# Altium project SLRC_Robot.PrjPcb (part 1 of 2)
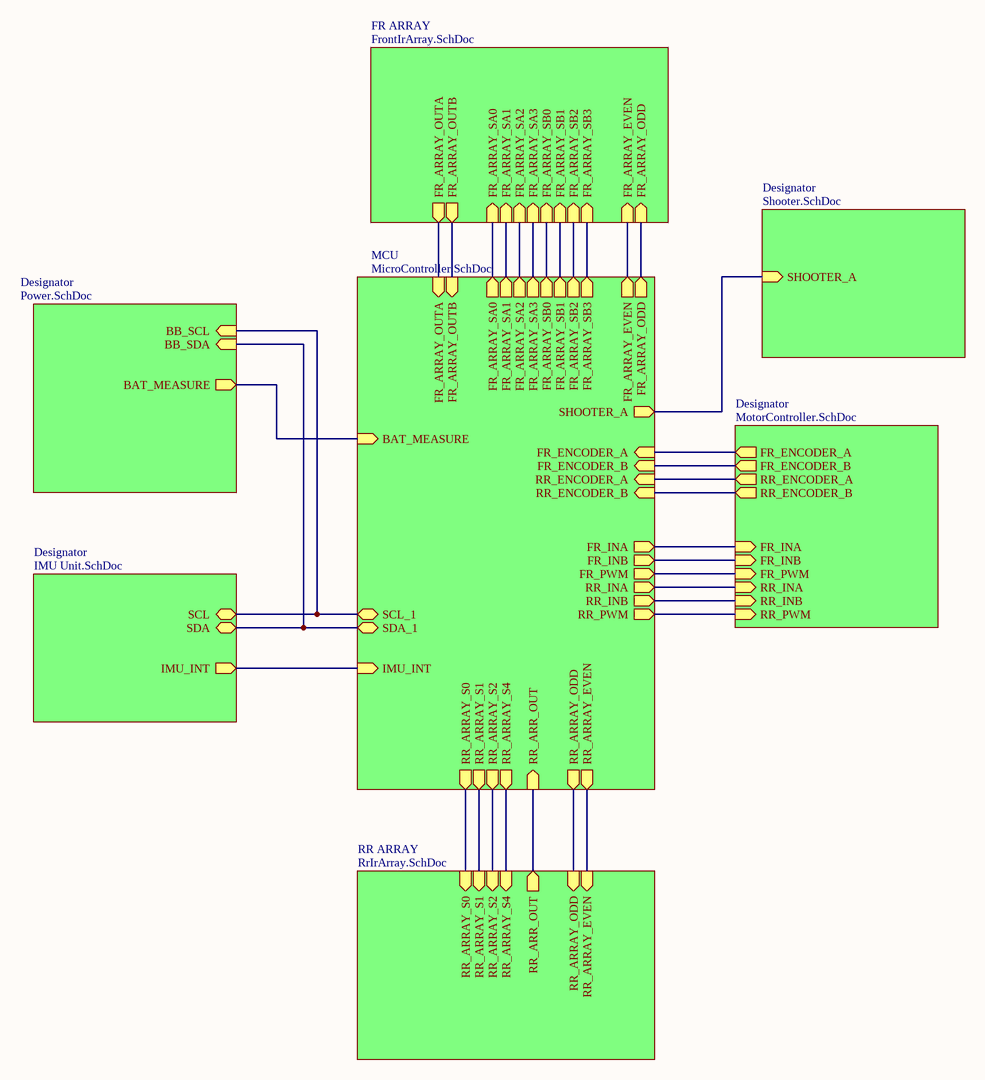
[diagram p0: Main.SchDoc]
11 sheets, 120 parts. Net scope: hierarchical (ports join the sheet entries above them; power ports are global).
Board file: RobotPCB.PcbDoc
Sheets:
  Main.SchDoc
    MCU = MicroController.SchDoc
    Designator = MotorController.SchDoc
    Designator = Shooter.SchDoc
    FR ARRAY = FrontIrArray.SchDoc
    RR ARRAY = RrIrArray.SchDoc
    Designator = IMU Unit.SchDoc
    Designator = Power.SchDoc
      Buck Converter = BuckConverter.SchDoc
      Buck Boost Converter = BuckBoost.SchDoc
      3.3V LDO = 3.3V_LDO.SchDoc

## Sheet Main.SchDoc
size B; SheetNumber: 1; SheetTotal: 11

### Sub-sheets
Designator = MotorController.SchDoc: FR_ENCODER_A (out), FR_ENCODER_B (out), RR_ENCODER_A (out), RR_ENCODER_B (out), FR_INA (in), FR_INB (in), FR_PWM (in), RR_INA (in), RR_INB (in), RR_PWM (in)
Designator = Shooter.SchDoc: SHOOTER_A (in)
Designator = IMU Unit.SchDoc: SCL (bidir), SDA (bidir), IMU_INT (out)
Designator = Power.SchDoc: BAT_MEASURE (out), BB_SCL (in), BB_SDA (in)
FR ARRAY = FrontIrArray.SchDoc: FR_ARRAY_SA0 (in), FR_ARRAY_SA1 (in), FR_ARRAY_SA2 (in), FR_ARRAY_SA3 (in), FR_ARRAY_SB0 (in), FR_ARRAY_SB1 (in), FR_ARRAY_SB2 (in), FR_ARRAY_SB3 (in), FR_ARRAY_OUTA (out), FR_ARRAY_OUTB (out), FR_ARRAY_EVEN (in), FR_ARRAY_ODD (in)
MCU = MicroController.SchDoc: SCL_1 (bidir), SDA_1 (bidir), IMU_INT (in), FR_ENCODER_A (in), FR_ENCODER_B (in), RR_ENCODER_A (in), RR_ENCODER_B (in), FR_INA (out), FR_INB (out), FR_PWM (out), RR_INA (out), RR_INB (out), RR_PWM (out), RR_ARRAY_S0 (out), RR_ARRAY_S1 (out), RR_ARRAY_S2 (out), RR_ARRAY_S4 (out), RR_ARR_OUT (in), FR_ARRAY_SA0 (out), FR_ARRAY_SA1 (out), FR_ARRAY_SA2 (out), FR_ARRAY_SA3 (out), FR_ARRAY_SB0 (out), FR_ARRAY_SB1 (out), FR_ARRAY_SB2 (out), FR_ARRAY_SB3 (out), FR_ARRAY_OUTA (in), FR_ARRAY_OUTB (in), BAT_MEASURE (in), SHOOTER_A (out), FR_ARRAY_EVEN (out), FR_ARRAY_ODD (out), RR_ARRAY_ODD (out), RR_ARRAY_EVEN (out)
RR ARRAY = RrIrArray.SchDoc: RR_ARRAY_S0 (in), RR_ARRAY_S1 (in), RR_ARRAY_S2 (in), RR_ARRAY_S4 (in), RR_ARR_OUT (out), RR_ARRAY_ODD (in), RR_ARRAY_EVEN (in)

### Nets
MCU_SCL_1: sheet MCU/SCL_1, sheet Designator/SCL, sheet Designator/BB_SCL
MCU_SDA_1: sheet MCU/SDA_1, sheet Designator/SDA, sheet Designator/BB_SDA
NetIC1_1: sheet MCU/FR_ARRAY_OUTA, sheet FR ARRAY/FR_ARRAY_OUTA
NetIC1_10: sheet MCU/FR_ARRAY_SA0, sheet FR ARRAY/FR_ARRAY_SA0
NetIC1_11: sheet MCU/FR_ARRAY_SA1, sheet FR ARRAY/FR_ARRAY_SA1
NetIC1_13: sheet MCU/FR_ARRAY_SA3, sheet FR ARRAY/FR_ARRAY_SA3
NetIC1_14: sheet MCU/FR_ARRAY_SA2, sheet FR ARRAY/FR_ARRAY_SA2
NetIC2_1: sheet MCU/FR_ARRAY_OUTB, sheet FR ARRAY/FR_ARRAY_OUTB
NetIC2_10: sheet MCU/FR_ARRAY_SB0, sheet FR ARRAY/FR_ARRAY_SB0
NetIC2_11: sheet MCU/FR_ARRAY_SB1, sheet FR ARRAY/FR_ARRAY_SB1
NetIC2_13: sheet MCU/FR_ARRAY_SB3, sheet FR ARRAY/FR_ARRAY_SB3
NetIC2_14: sheet MCU/FR_ARRAY_SB2, sheet FR ARRAY/FR_ARRAY_SB2
NetIC3_1: sheet MCU/RR_ARR_OUT, sheet RR ARRAY/RR_ARR_OUT
NetIC3_10: sheet MCU/RR_ARRAY_S0, sheet RR ARRAY/RR_ARRAY_S0
NetIC3_11: sheet MCU/RR_ARRAY_S1, sheet RR ARRAY/RR_ARRAY_S1
NetIC3_13: sheet MCU/RR_ARRAY_S4, sheet RR ARRAY/RR_ARRAY_S4
NetIC3_14: sheet MCU/RR_ARRAY_S2, sheet RR ARRAY/RR_ARRAY_S2
NetIC6_5: sheet MCU/SHOOTER_A, sheet Designator/SHOOTER_A
NetJ20_2: sheet MCU/RR_PWM, sheet Designator/RR_PWM
NetJ20_4: sheet MCU/RR_INB, sheet Designator/RR_INB
NetJ20_5: sheet MCU/RR_INA, sheet Designator/RR_INA
NetJ20_6: sheet MCU/FR_PWM, sheet Designator/FR_PWM
NetJ20_8: sheet MCU/FR_INB, sheet Designator/FR_INB
NetJ20_9: sheet MCU/FR_INA, sheet Designator/FR_INA
NetJ22_5: sheet MCU/FR_ENCODER_A, sheet Designator/FR_ENCODER_A
NetJ22_6: sheet MCU/FR_ENCODER_B, sheet Designator/FR_ENCODER_B
NetJ24_5: sheet MCU/RR_ENCODER_A, sheet Designator/RR_ENCODER_A
NetJ24_6: sheet MCU/RR_ENCODER_B, sheet Designator/RR_ENCODER_B
NetP3_17: sheet MCU/RR_ARRAY_ODD, sheet RR ARRAY/RR_ARRAY_ODD
NetP3_18: sheet MCU/RR_ARRAY_EVEN, sheet RR ARRAY/RR_ARRAY_EVEN
NetP4_5: sheet MCU/FR_ARRAY_EVEN, sheet FR ARRAY/FR_ARRAY_EVEN
NetP4_6: sheet MCU/FR_ARRAY_ODD, sheet FR ARRAY/FR_ARRAY_ODD
NetR15_1: sheet MCU/BAT_MEASURE, sheet Designator/BAT_MEASURE
NetU1_5: sheet MCU/IMU_INT, sheet Designator/IMU_INT

## Sheet MicroController.SchDoc
size 680 x 279 mm; SheetNumber: 2; SheetTotal: 11
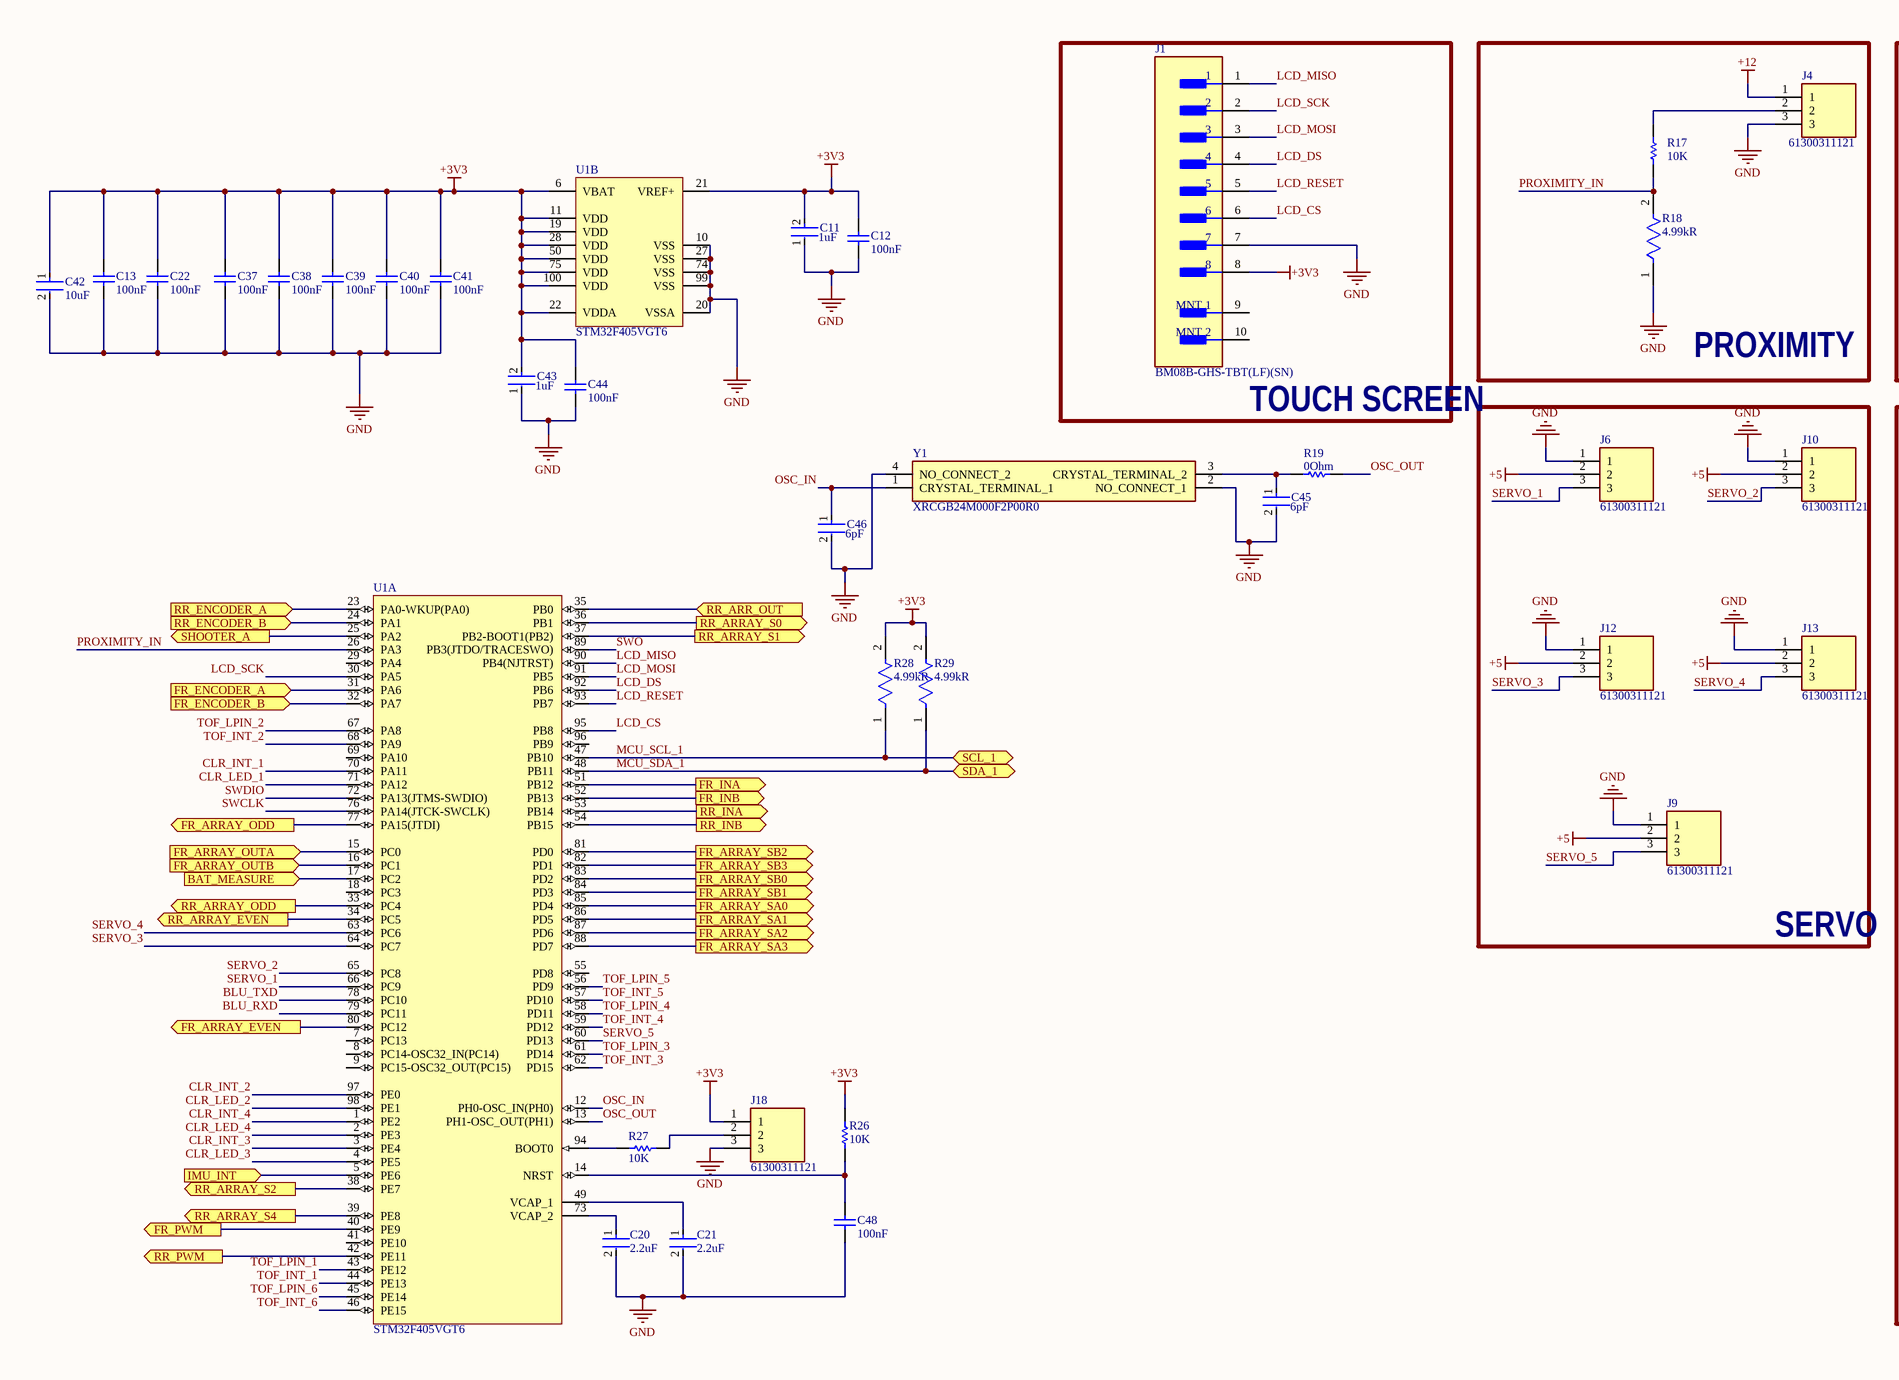
[diagram p1: MicroController.SchDoc, left]
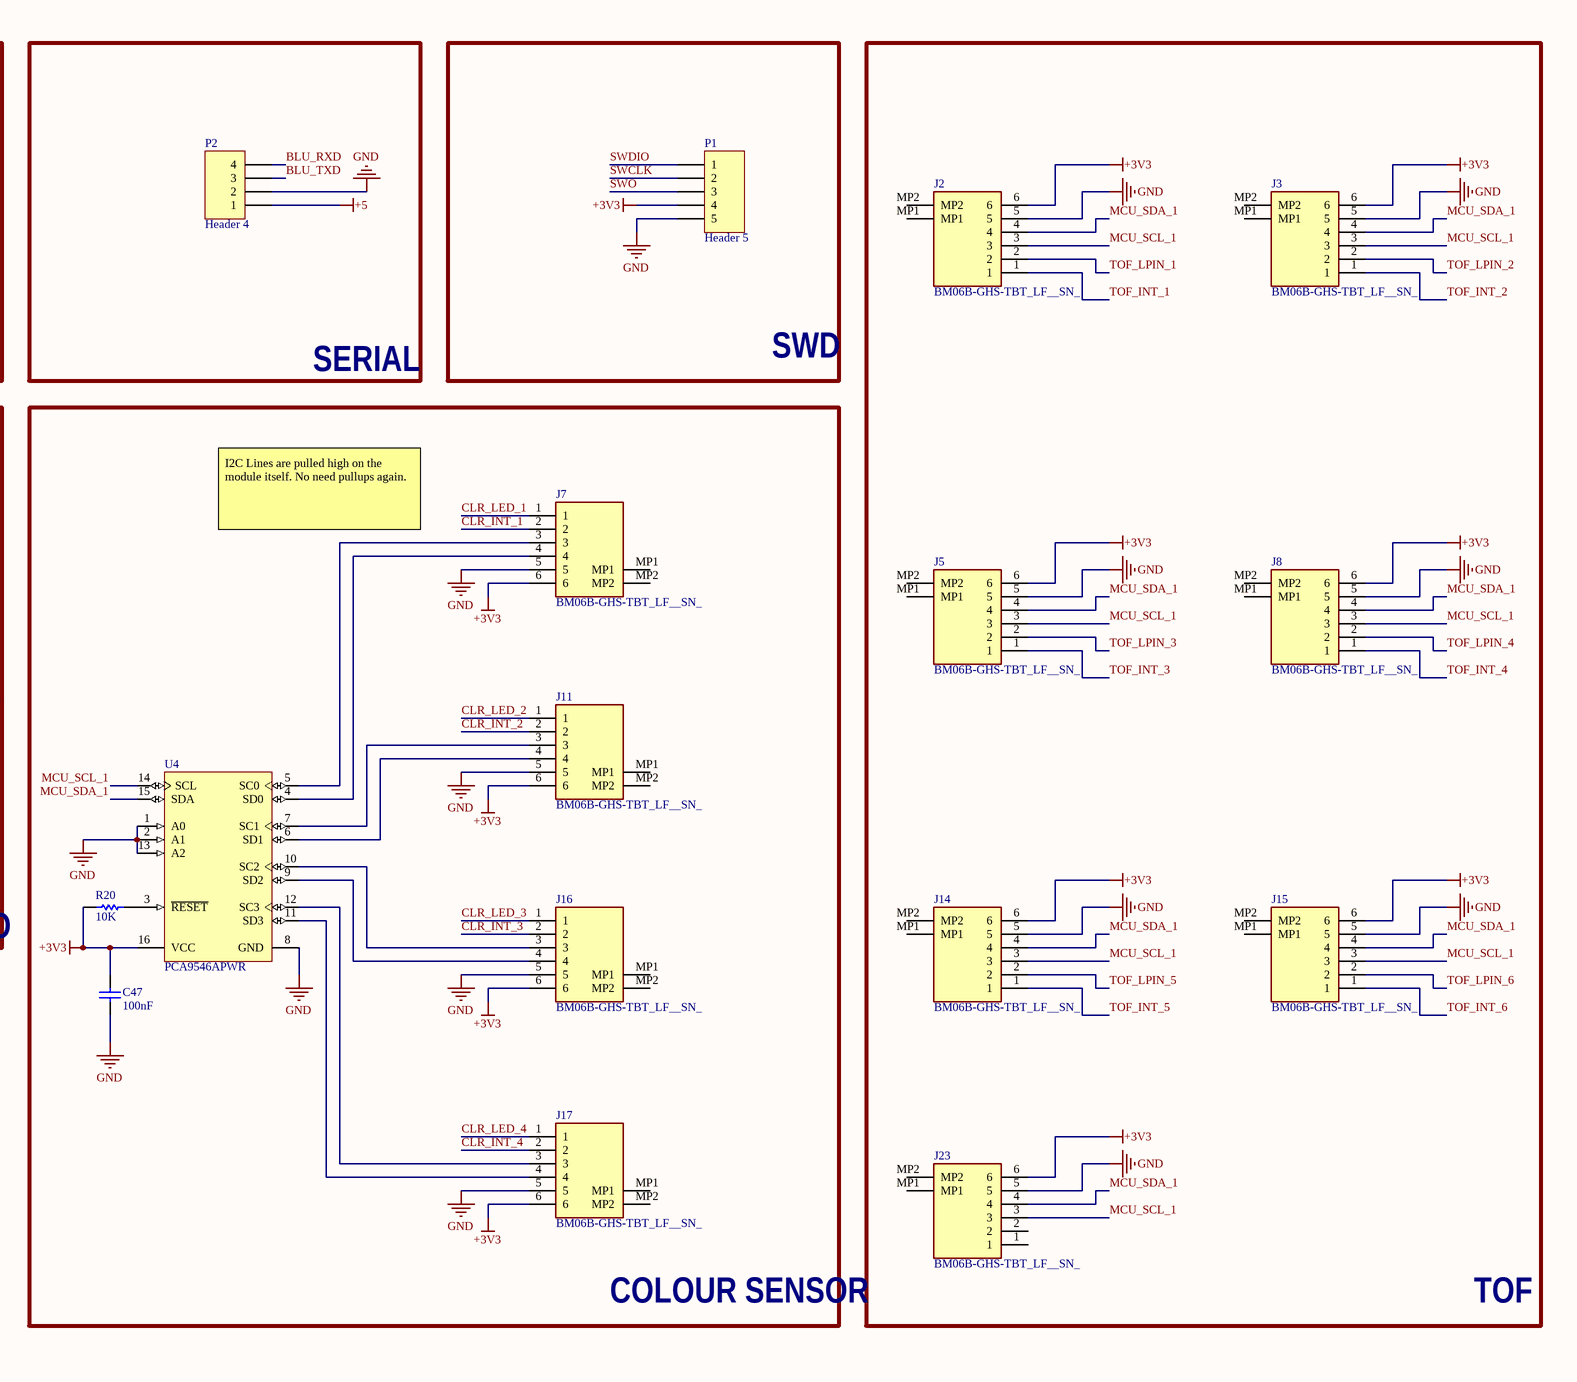
[diagram p2: MicroController.SchDoc, right]

### Parts
C11  Capacitance: 1uF  [FP-C1608-080-0_1-IPC_B]  (hidden comment: C1608X5R1H105K080AB)
C12  Capacitance: 100nF  [CAPC1050X55X23ML05T13]  (hidden comment: CL05B104KO5NNNC)
C13  Capacitance: 100nF  [CAPC1050X55X23ML05T13]  (hidden comment: CL05B104KO5NNNC)
C20  Capacitance: 2.2uF  [FP-GRM155-0_05-MFG]  (hidden comment: GRM155R61A225KE95D)
C21  Capacitance: 2.2uF  [FP-GRM155-0_05-MFG]  (hidden comment: GRM155R61A225KE95D)
C22  Capacitance: 100nF  [CAPC1050X55X23ML05T13]  (hidden comment: CL05B104KO5NNNC)
C37  Capacitance: 100nF  [CAPC1050X55X23ML05T13]  (hidden comment: CL05B104KO5NNNC)
C38  Capacitance: 100nF  [CAPC1050X55X23ML05T13]  (hidden comment: CL05B104KO5NNNC)
C39  Capacitance: 100nF  [CAPC1050X55X23ML05T13]  (hidden comment: CL05B104KO5NNNC)
C40  Capacitance: 100nF  [CAPC1050X55X23ML05T13]  (hidden comment: CL05B104KO5NNNC)
C41  Capacitance: 100nF  [CAPC1050X55X23ML05T13]  (hidden comment: CL05B104KO5NNNC)
C42  Capacitance: 10uF  [FP-CL05A106MP5NUNC-MFG]  (hidden comment: CL05A106MP5NUNC)
C43  Capacitance: 1uF  [FP-C1608-080-0_1-IPC_B]  (hidden comment: C1608X5R1H105K080AB)
C44  Capacitance: 100nF  [CAPC1050X55X23ML05T13]  (hidden comment: CL05B104KO5NNNC)
C45  value 6pF  [FP-GRT155-0_05-MFG]  (hidden comment: GRT1555C1H6R0DA02D)
C46  value 6pF  [FP-GRT155-0_05-MFG]  (hidden comment: GRT1555C1H6R0DA02D)
C47  Capacitance: 100nF  [CAPC1050X55X23ML05T13]  (hidden comment: CL05B104KO5NNNC)
C48  Capacitance: 100nF  [CAPC1050X55X23ML05T13]  (hidden comment: CL05B104KO5NNNC)
J1  BM08B-GHS-TBT(LF)(SN)  [FP-BM08B-GHS-TBT_LF_SN-MFG]
J2  BM06B-GHS-TBT_LF__SN_  [BM06BGHSTBTLFSN]
J3  BM06B-GHS-TBT_LF__SN_  [BM06BGHSTBTLFSN]
J4  61300311121  [HDRV3W64P0X254_1X3_762X254X869P]
J5  BM06B-GHS-TBT_LF__SN_  [BM06BGHSTBTLFSN]
J6  61300311121  [HDRV3W64P0X254_1X3_762X254X869P]
J7  BM06B-GHS-TBT_LF__SN_  [BM06BGHSTBTLFSN]
J8  BM06B-GHS-TBT_LF__SN_  [BM06BGHSTBTLFSN]
J9  61300311121  [HDRV3W64P0X254_1X3_762X254X869P]
J10  61300311121  [HDRV3W64P0X254_1X3_762X254X869P]
J11  BM06B-GHS-TBT_LF__SN_  [BM06BGHSTBTLFSN]
J12  61300311121  [HDRV3W64P0X254_1X3_762X254X869P]
J13  61300311121  [HDRV3W64P0X254_1X3_762X254X869P]
J14  BM06B-GHS-TBT_LF__SN_  [BM06BGHSTBTLFSN]
J15  BM06B-GHS-TBT_LF__SN_  [BM06BGHSTBTLFSN]
J16  BM06B-GHS-TBT_LF__SN_  [BM06BGHSTBTLFSN]
J17  BM06B-GHS-TBT_LF__SN_  [BM06BGHSTBTLFSN]
J18  61300311121  [HDRV3W64P0X254_1X3_762X254X869P]
J23  BM06B-GHS-TBT_LF__SN_  [BM06BGHSTBTLFSN]
P1  Header 5  [HDR1X5]
P2  Header 4  [HDR1X4]
R17  Resistance: 10K  [RESC1005X40X25LL05T10]  (hidden comment: RC0402FR-0710KL)
R18  Resistance: 4.99kR  [FP-CRCW0402-e3-MFG]  (hidden comment: CRCW04024K99FKED)
R19  value 0Ohm  [RESC1005X40X25NL05T10]  (hidden comment: RC0402JR-070RL)
R20  Resistance: 10K  [RESC1005X40X25LL05T10]  (hidden comment: RC0402FR-0710KL)
R26  Resistance: 10K  [RESC1005X40X25LL05T10]  (hidden comment: RC0402FR-0710KL)
R27  Resistance: 10K  [RESC1005X40X25LL05T10]  (hidden comment: RC0402FR-0710KL)
R28  Resistance: 4.99kR  [FP-CRCW0402-e3-MFG]  (hidden comment: CRCW04024K99FKED)
R29  Resistance: 4.99kR  [FP-CRCW0402-e3-MFG]  (hidden comment: CRCW04024K99FKED)
U1  STM32F405VGT6  [STM-LQFP100_V]  (parts A,B of 2)
U4  PCA9546APWR  [PW0016A_N]
Y1  XRCGB24M000F2P00R0  [XRCGB24M000F2P00R0]

### Blocks framed on the sheet
TOUCH SCREEN: J1
PROXIMITY: J4 R17 R18
SERIAL: P2
SWD: P1
TOF: J2 J3 J5 J8 J14 J15 J23
SERVO: J6 J9 J10 J12 J13
COLOUR SENSOR: C47 J7 J11 J16 J17 R20 U4

### Ports
BAT_MEASURE (in, see Main[3B], Power[1B]), FR_ARRAY_EVEN (out, see Main[4B], FrontIrArray[1B]), FR_ARRAY_ODD (out, see Main[4B], FrontIrArray[2B]), FR_ARRAY_OUTA (in, see Main[3B], FrontIrArray[2A]), FR_ARRAY_OUTB (in, see Main[3B], FrontIrArray[2B]), FR_ARRAY_SA0 (out, see Main[3B], FrontIrArray[2B]), FR_ARRAY_SA1 (out, see Main[3B], FrontIrArray[2B]), FR_ARRAY_SA2 (out, see Main[3B], FrontIrArray[4B]), FR_ARRAY_SA3 (out, see Main[3B], FrontIrArray[4B]), FR_ARRAY_SB0 (out, see Main[3B], FrontIrArray[2C]), FR_ARRAY_SB1 (out, see Main[3B], FrontIrArray[2C]), FR_ARRAY_SB2 (out, see Main[4B], FrontIrArray[4C]), FR_ARRAY_SB3 (out, see Main[4B], FrontIrArray[4C]), FR_ENCODER_A (in, see Main[4B], MotorController[4B]), FR_ENCODER_B (in, see Main[4B], MotorController[4B]), FR_INA (out, see Main[4B], MotorController[1B]), FR_INB (out, see Main[4C], MotorController[1B]), FR_PWM (out, see Main[4C], MotorController[1B]), IMU_INT (in, see Main[3C], IMU Unit[3B]), RR_ARR_OUT (in, see Main[3C], RrIrArray[3B]), RR_ARRAY_EVEN (out, see Main[4C], RrIrArray[2B]), RR_ARRAY_ODD (out, see Main[4C], RrIrArray[1B]), RR_ARRAY_S0 (out, see Main[3C], RrIrArray[3B]), RR_ARRAY_S1 (out, see Main[3C], RrIrArray[3B]), RR_ARRAY_S2 (out, see Main[3C], RrIrArray[4B]), RR_ARRAY_S4 (out, see Main[3C], RrIrArray[4B]), RR_ENCODER_A (in, see Main[4B], MotorController[4C]), RR_ENCODER_B (in, see Main[4B], MotorController[4C]), RR_INA (out, see Main[4C], MotorController[1B]), RR_INB (out, see Main[4C], MotorController[1B]), RR_PWM (out, see Main[4C], MotorController[1B]), SCL_1 (bidir, see Main[3C]), SDA_1 (bidir, see Main[3C]), SHOOTER_A (out, see Main[4B], Shooter[3B])

### Nets
+3V3: C11.2 C12.1 C13.1 C22.1 C37.1 C38.1 C39.1 C40.1 C41.1 C42.1 C43.2 C44.1 C47.1 J1.8 J2.6 J3.6 J5.6 J7.6 J8.6 J11.6 J14.6 J15.6 J16.6 J17.6 J18.1 J23.6 P1.4 R20.2 R26.1 R28.2 R29.2 U1.6(VBAT) U1.11(VDD) U1.19(VDD) U1.21(VREF+) U1.22(VDDA) U1.28(VDD) U1.50(VDD) U1.75(VDD) U1.100(VDD) U4.16(VCC)
+5: J6.2 J9.2 J10.2 J12.2 J13.2 P2.1
+12: J4.1
GND: C11.1 C12.2 C13.2 C20.2 C21.2 C22.2 C37.2 C38.2 C39.2 C40.2 C41.2 C42.2 C43.1 C44.2 C45.2 C46.2 C47.2 C48.2 J1.7 J2.5 J3.5 J4.3 J5.5 J6.1 J7.5 J8.5 J9.1 J10.1 J11.5 J12.1 J13.1 J14.5 J15.5 J16.5 J17.5 J18.3 J23.5 P1.5 P2.2 R18.1 U1.10(VSS) U1.20(VSSA) U1.27(VSS) U1.74(VSS) U1.99(VSS) U4.1(A0) U4.2(A1) U4.8(GND) U4.13(A2) Y1.2(NO_CONNECT_1) Y1.4(NO_CONNECT_2)
BLU_RXD: P2.4 U1.79(PC11)
BLU_TXD: P2.3 U1.78(PC10)
CLR_INT_1: J7.2 U1.70(PA11)
CLR_INT_2: J11.2 U1.97(PE0)
CLR_INT_3: J16.2 U1.3(PE4)
CLR_INT_4: J17.2 U1.1(PE2)
CLR_LED_1: J7.1 U1.71(PA12)
CLR_LED_2: J11.1 U1.98(PE1)
CLR_LED_3: J16.1 U1.4(PE5)
CLR_LED_4: J17.1 U1.2(PE3)
LCD_CS: J1.6 U1.95(PB8)
LCD_DS: J1.4 U1.92(PB6)
LCD_MISO: J1.1 U1.90(PB4(NJTRST))
LCD_MOSI: J1.3 U1.91(PB5)
LCD_RESET: J1.5 U1.93(PB7)
LCD_SCK: J1.2 U1.30(PA5)
MCU_SCL_1: J2.3 J3.3 J5.3 J8.3 J14.3 J15.3 J23.3 R28.1 U1.47(PB10) U4.14(SCL) ; port SCL_1
MCU_SDA_1: J2.4 J3.4 J5.4 J8.4 J14.4 J15.4 J23.4 R29.1 U1.48(PB11) U4.15(SDA) ; port SDA_1
OSC_IN: C46.1 U1.12(PH0-OSC_IN(PH0)) Y1.1(CRYSTAL_TERMINAL_1)
OSC_OUT: R19.2 U1.13(PH1-OSC_OUT(PH1))
PROXIMITY_IN: R17.1 R18.2 U1.26(PA3)
SERVO_1: J6.3 U1.66(PC9)
SERVO_2: J10.3 U1.65(PC8)
SERVO_3: J12.3 U1.64(PC7)
SERVO_4: J13.3 U1.63(PC6)
SERVO_5: J9.3 U1.60(PD13)
SWCLK: P1.2 U1.76(PA14(JTCK-SWCLK))
SWDIO: P1.1 U1.72(PA13(JTMS-SWDIO))
SWO: P1.3 U1.89(PB3(JTDO/TRACESWO))
TOF_INT_1: J2.1 U1.44(PE13)
TOF_INT_2: J3.1 U1.68(PA9)
TOF_INT_3: J5.1 U1.62(PD15)
TOF_INT_4: J8.1 U1.59(PD12)
TOF_INT_5: J14.1 U1.57(PD10)
TOF_INT_6: J15.1 U1.46(PE15)
TOF_LPIN_1: J2.2 U1.43(PE12)
TOF_LPIN_2: J3.2 U1.67(PA8)
TOF_LPIN_3: J5.2 U1.61(PD14)
TOF_LPIN_4: J8.2 U1.58(PD11)
TOF_LPIN_5: J14.2 U1.56(PD9)
TOF_LPIN_6: J15.2 U1.45(PE14)
NetC20_1: C20.1 U1.73(VCAP_2)
NetC21_1: C21.1 U1.49(VCAP_1)
NetC45_1: C45.1 R19.1 Y1.3(CRYSTAL_TERMINAL_2)
NetC48_1: C48.1 R26.2 U1.14(NRST)
NetIC1_1: U1.15(PC0) ; port FR_ARRAY_OUTA
NetIC1_10: U1.85(PD4) ; port FR_ARRAY_SA0
NetIC1_11: U1.86(PD5) ; port FR_ARRAY_SA1
NetIC1_13: U1.88(PD7) ; port FR_ARRAY_SA3
NetIC1_14: U1.87(PD6) ; port FR_ARRAY_SA2
NetIC2_1: U1.16(PC1) ; port FR_ARRAY_OUTB
NetIC2_10: U1.83(PD2) ; port FR_ARRAY_SB0
NetIC2_11: U1.84(PD3) ; port FR_ARRAY_SB1
NetIC2_13: U1.82(PD1) ; port FR_ARRAY_SB3
NetIC2_14: U1.81(PD0) ; port FR_ARRAY_SB2
NetIC3_1: U1.35(PB0) ; port RR_ARR_OUT
NetIC3_10: U1.36(PB1) ; port RR_ARRAY_S0
NetIC3_11: U1.37(PB2-BOOT1(PB2)) ; port RR_ARRAY_S1
NetIC3_13: U1.39(PE8) ; port RR_ARRAY_S4
NetIC3_14: U1.38(PE7) ; port RR_ARRAY_S2
NetIC6_5: U1.25(PA2) ; port SHOOTER_A
NetJ4_2: J4.2 R17.2
NetJ7_3: J7.3 U4.5(SC0)
NetJ7_4: J7.4 U4.4(SD0)
NetJ11_3: J11.3 U4.7(SC1)
NetJ11_4: J11.4 U4.6(SD1)
NetJ16_3: J16.3 U4.10(SC2)
NetJ16_4: J16.4 U4.9(SD2)
NetJ17_3: J17.3 U4.12(SC3)
NetJ17_4: J17.4 U4.11(SD3)
NetJ18_2: J18.2 R27.1
NetJ20_2: U1.42(PE11) ; port RR_PWM
NetJ20_4: U1.54(PB15) ; port RR_INB
NetJ20_5: U1.53(PB14) ; port RR_INA
NetJ20_6: U1.40(PE9) ; port FR_PWM
NetJ20_8: U1.52(PB13) ; port FR_INB
NetJ20_9: U1.51(PB12) ; port FR_INA
NetJ22_5: U1.31(PA6) ; port FR_ENCODER_A
NetJ22_6: U1.32(PA7) ; port FR_ENCODER_B
NetJ24_5: U1.23(PA0-WKUP(PA0)) ; port RR_ENCODER_A
NetJ24_6: U1.24(PA1) ; port RR_ENCODER_B
NetP3_17: U1.33(PC4) ; port RR_ARRAY_ODD
NetP3_18: U1.34(PC5) ; port RR_ARRAY_EVEN
NetP4_5: U1.80(PC12) ; port FR_ARRAY_EVEN
NetP4_6: U1.77(PA15(JTDI)) ; port FR_ARRAY_ODD
NetR15_1: U1.17(PC2) ; port BAT_MEASURE
NetR20_1: R20.1 U4.3(~{RESET})
NetR27_2: R27.2 U1.94(BOOT0)
NetU1_5: U1.5(PE6) ; port IMU_INT

Not connected (* = marked no-connect by the designer): J1 9(MNT_1) 10(MNT_2); J2 MP1 MP2; J3 MP1 MP2; J5 MP1 MP2; J7 MP1 MP2; J8 MP1 MP2; J11 MP1 MP2; J14 MP1 MP2; J15 MP1 MP2; J16 MP1 MP2; J17 MP1 MP2; J23 1 2 MP1 MP2; U1 7(PC13) 8(PC14-OSC32_IN(PC14)) 9(PC15-OSC32_OUT(PC15)) 18(PC3) 29(PA4) 41(PE10) 55(PD8) 69(PA10) 96(PB9)

### Notes on the sheet
- I2C Lines are pulled high on the module itself. No need pullups again.

### Library data of the parts
C11 C43 = CMP-2000-06025-2: Multilayer Ceramic Capacitors 1μF ±10% 50V X5R SMD 0603; Lead Free: Lead Free; Height: 0.8mm; Mount: Surface Mount; Radiation Hardening: No; Thickness: 0.035inch; Length: 1.6mm; Max Operating Temperature: 85°C; REACH SVHC: No SVHC; Min Operating Temperature: -55°C; Construction: Flat; RoHS Compliant: Yes; Voltage Rating: 50V; Dielectric: X5R; Packaging: Tape and Reel; Termination: SMD/SMT; Voltage Rating (DC): 50V; Case Code (Imperial): 0603; Voltage: 50V; Width: 0.031inch; Weight: 7.1E-05oz; Depth: 0.8mm; Case Code (Metric): 1608; Series: C; Case/Package: 0603; Tolerance: 10%; Resistor Type: Ceramic; Number of Pins: 2; Dielectric Material: Ceramic; Package Quantity: 1
C12 C13 C22 C37-C41 C44 C47 C48 = CMP-2000-05439-1: Chip Capacitor, 100 nF, +/- 10%, 16 V, -55 to 125 degC, 0402 (1005 Metric), RoHS, Tape and Reel; Manufacturer: Samsung Electro-Mechanics; Dielectric: X7R; Rated Voltage: 16V; Case Size/Dimension: 0402; Tolerance (%): ±10%; Manufacturer URL: http://www.samsungsem.com/global/index.jsp; Datasheet URL: https://datasheet.ciiva.com/29198/458718-da-01-en-vs-kondensator-0402-29198423.pdf; Datasheet Version: Nov-10
C20 C21 = CMP-06035-063009-1: CAP CER 2.2UF 10V X5R 0402; Material: Ceramic; Tolerance: 10%; Max Operating Temperature: 85°C; Min Operating Temperature: -55°C; Weight: 0.000212oz; Lead Free: Lead Free; Case Code (Imperial): 0402; Case Code (Metric): 1005; Length: 1mm; Packaging: Tape and Reel; Depth: 0.5mm; Voltage Rating: 10V; REACH SVHC: No SVHC; Width: 0.5mm; Case/Package: 0402; RoHS Compliant: Yes; Termination: SMD/SMT; Voltage Rating (DC): 10V; Height: 0.5mm; Mount: Surface Mount; Package Quantity: 10000; Dielectric: X5R; Thickness: 0.022inch
C42 = CMP-13271-000002-1: CAP CER 10UF 10V X5R 0402; Manufacturer: Samsung; Temperature Coefficient: 15%; Tolerance: 20%; Material: Ceramic; Octopart: https://octopart.com/cl05a106mp5nunc-samsung-22457395; Voltage Rating: 10V; RoHS: TRUE; Value: 10uF; Height: 0.7mm; Digikey Description: CAP CER 10UF 10V X5R 0402; Automotive: No; Package: CL05A106MP5NUNC; Device Class L1: Passive Components; Temperature Range High: +85°C; ComponentLink2Description: Datasheet; Device Class L2: Capacitors; Temperature Characteristic: X5R; Manufacturer Part Number: CL05A106MP5NUNC; Temperature: -55°C to +85°C; ComponentLink2URL: http://www.samsungsem.com/kr/support/product-search/mlcc/__icsFiles/afieldfile/2019/05/10/19-CL05A106MP5NUNC.pdf; Device Class L3: Ceramic Capacitors; Category: Cap; Temperature Range Low: -55°C; Ipc Land Pattern Name: CAPC10050X50; Lead Free: Yes
C45 C46 = CMP-06035-048499-1: Multi-Layer Ceramic Capacitor 6pF 50V C0G ±0.5pF 0402 Paper T/R
J1 = CMP-17439-000100-1: CONN HEADER SMD 8POS 1.25MM; Number of Positions: 8; Voltage Rating (AC): 50V; Wire/Cable Gauge: 26AWG; Current Rating: 1A; Lead Free: Lead Free; Max Operating Temperature: 85°C; Contact Material: Bronze; Housing Material: Nylon; Number of Rows: 1; Orientation: Straight; Packaging: Cut Tape; Contact Plating: Tin; Housing Color: Natural; REACH SVHC: No SVHC; Min Operating Temperature: -25°C; Series: GH; Voltage Rating: 50V; Pitch: 1.25mm; Number of Contacts: 8; Case/Package: SMD/SMT; Termination: SMD/SMT
J2 J3 J5 J7 J8 J11 J14-J17 J23 = BM06B-GHS-TBT_LF__SN_: Connector; Manufacturer_Name: JST (JAPAN SOLDERLESS TERMINALS); Manufacturer_Part_Number: BM06B-GHS-TBT(LF)(SN); Datasheet Link: https://datasheet.lcsc.com/szlcsc/2004111131_JST-Sales-America-BM06B-GHS-TBT-LF-SN_C495534.pdf; Height: 4.05mm
  J5: Supplier 1: LCSC; Supplier Part Number 1: C189892
J4 J6 J9 J10 J12 J13 J18 = 61300311121: Connector; Manufacturer_Name: Wurth Elektronik; Datasheet Link: http://katalog.we-online.de/em/datasheet/6130xx11121.pdf; Height: 8.69mm; Manufacturer_Part_Number: 61300311121; Mouser Part Number: 710-61300311121; Mouser Price/Stock: https://www.mouser.co.uk/ProductDetail/Wurth-Elektronik/61300311121?qs=PhR8RmCirEYxRWFJzNKsUw%3D%3D
P1 = Header 5: Header, 5-Pin; LatestRevisionDate: 17-Jul-2002; LatestRevisionNote: Re-released for DXP Platform.; Publisher: Altium Limited
P2 = Header 4: Header, 4-Pin; LatestRevisionDate: 17-Jul-2002; LatestRevisionNote: Re-released for DXP Platform.; Publisher: Altium Limited
R17 R20 R26 R27 = CMP-2002-07353-1: Manufacturer: Yageo / Phycomp; Part Number: RC0402FR-0710KL
R18 R28 R29 = CMP-2002-00057-2: RES Thick Film, 4.99kΩ, 1%, 0.063W, 100ppm/°C, 0402; Power Rating: 63mW; Voltage Rating: 50V; Package Quantity: 10; Max Power Dissipation: 63mW; Temperature Coefficient: 100ppm/°C; Lead Free: Lead Free; Mount: Surface Mount; Height: 0.35mm; Number of Terminations: 2; Contact Plating: Tin; Case/Package: 0402; Max Operating Temperature: 155°C; Case Code (Imperial): 0402; Weight: 2.3E-05oz; Width: 0.5mm; Features: Automotive AEC-Q200; Voltage Rating (DC): 50V; Tolerance: 1%; Min Operating Temperature: -55°C; Length: 1mm; Depth: 0.5mm; Military Standard: Not; Packaging: Tape and Reel; Radiation Hardening: No; Composition: Thick Film; Termination: SMD/SMT; Case Code (Metric): 1005
R19 = CMP-1011-00001-2: Manufacturer: Yageo / Phycomp; Part Number: RC0402JR-070RL
U1 = CMP-0243-00020-3: ARM Cortex-M4 32-bit MCU+FPU, 210 DMIPS, 1024 kB Flash, 192 kB Internal RAM, 82 I/Os, 100-pin LQFP, -40 to 85 degC, Tray; Manufacturer: STMicroelectronics; Operating Frequency(F) (Processor speed) (MHz): 168; Supply Voltage(Vcc) max (V): 3.6; D/A Converter: 2x12-bit; Internal RAM Size (kB): 192; Supply Voltage(Vcc) min (V): 1.8; I/Os (High Current): 82; FLASH Size (Prog) (kB): 1024; PackageDescription: 100-Pin Low Profile Quad Flat Package, 14 x 14 mm Body, 0.5 mm Pitch; PackageReference: LQFP100; PartNumber: STM32F405VGT6; ComponentLink1URL: http://www.st.com/web/en/home.html; ComponentLink2Description: Datasheet; ComponentLink3Description: Package Specification; Mounting Technology: Surface Mount; DatasheetVersion: Rev. 4; ComponentLink1Description: Manufacturer URL; PackageVersion: Rev. 1, 06/2013; ComponentLink2URL: http://www.st.com/st-web-ui/static/active/en/resource/technical/document/datasheet/DM00037051.pdf; ComponentLink3URL: http://www.st.com/st-web-ui/static/active/en/resource/technical/document/data_brief/DM00071938.pdf; Core: ARM Cortex-M4; Packing: Tray
U4 = CMP-0314-00274-2: 4-Channel I2C and SMBus Multiplexer with Reset Functions, 2.3 to 5.5 V, -40 to 85 degC, 16-pin TSSOP (PW), Green (RoHS & no Sb/Br); Manufacturer: Texas Instruments; Simultaneously Active Channels: 1 to 4; fSCLK(Max)(MHz): 100, 400; VCC(Max)(V): 5.5; tpd max(ns): 0.3, 1; 5V Tolerant I/O: Yes; SubFamily: I2C Multiplexer, Switch; Channel Width: 4; I2C Address: 1110 xxx; VCC(Min)(V): 2.3; Max Frequency(kHz): 400; Eco-Plan: Green (RoHS & no Sb/Br); ComponentLink1URL: http://www.ti.com/general/docs/lit/getliterature.tsp?genericPartNumber=PCA9546A&fileType=pdf; Code_JEDEC: MO-153; PackageDescription: 16-Pin Plastic Thin Small Outline Package 5 x 4.4 mm Body ,0.65 mm Pitch; PartNumber: PCA9546APWR; Reset Input: Yes; Mounting Technology: Surface Mount; Open Drain I/O Type: Yes; ComponentLink1Description: Datasheet; PackageReference: PW0016A; DatasheetVersion: SCPS148E; Vcc range(V): 2.3 to 5.5; PackageVersion: revG, Feb-2011
Y1 = XRCGB24M000F2P00R0: Crystal or Oscillator; Manufacturer_Name: Murata Electronics; Datasheet Link: https://www.murata.com/products/productdata/8801057734686/SPEC-XRCGB24M000F2P00R0.pdf; Height: 0.7mm; Manufacturer_Part_Number: XRCGB24M000F2P00R0; Mouser Part Number: 81-XRCGB24M000F2P0R0; Mouser Price/Stock: https://www.mouser.co.uk/ProductDetail/Murata-Electronics/XRCGB24M000F2P00R0?qs=gvhpkjpQEVQGHd411wA%252BwA%3D%3D; Arrow Part Number: XRCGB24M000F2P00R0; Arrow Price/Stock: https://www.arrow.com/en/products/xrcgb24m000f2p00r0/murata-manufacturing?region=nac

## Sheet MotorController.SchDoc
size A; SheetNumber: 3; SheetTotal: 11
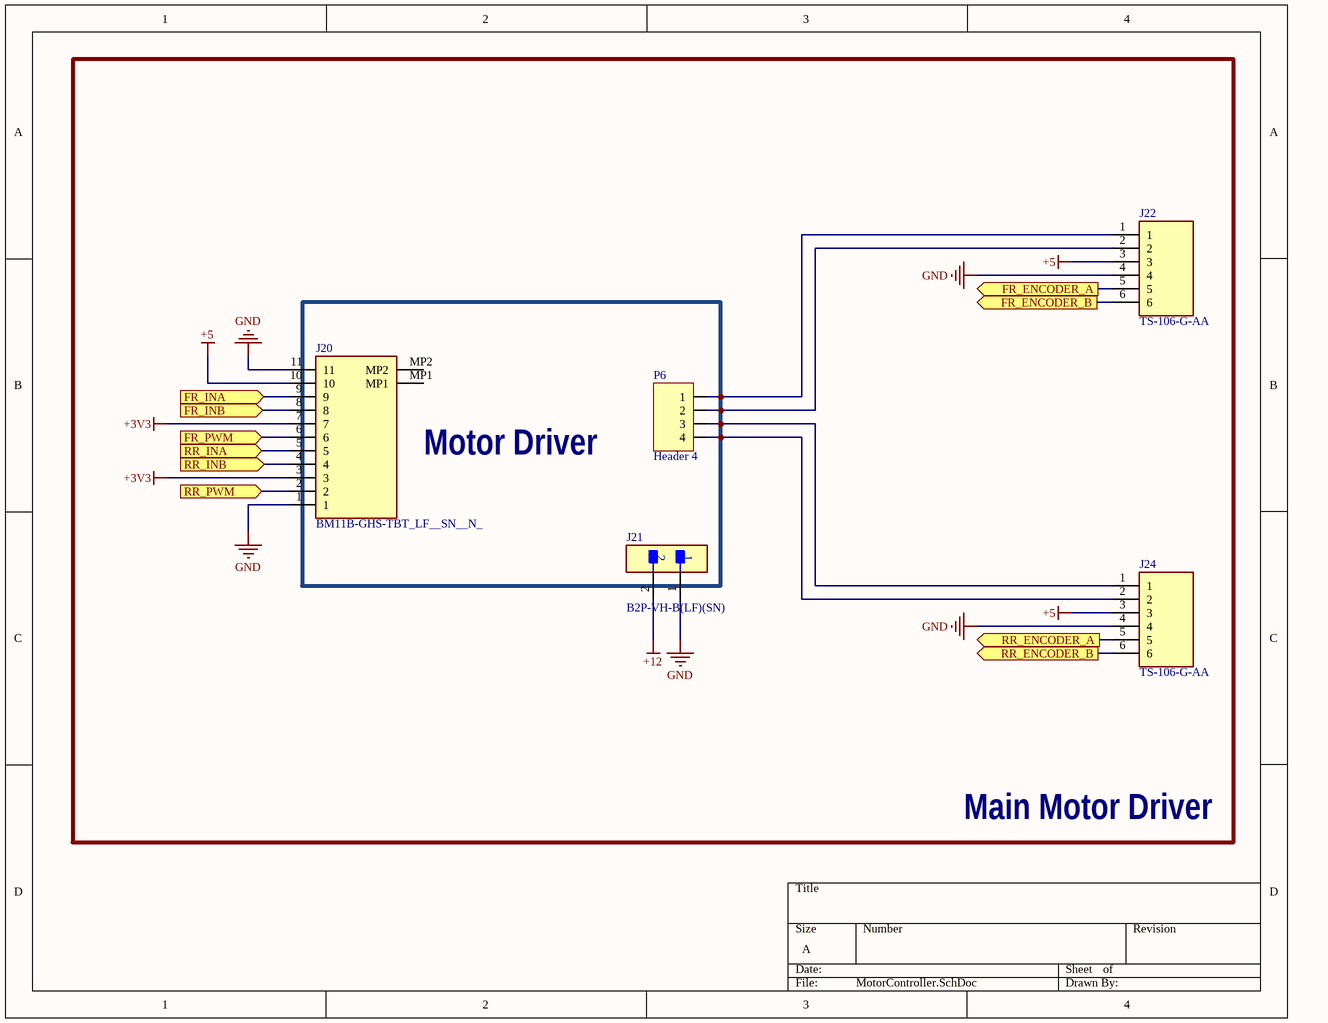
[diagram p3: MotorController.SchDoc]

### Parts
J20  BM11B-GHS-TBT_LF__SN__N_  [BM11BGHSTBTLFSNN]
J21  B2P-VH-B(LF)(SN)  [FP-B2P-VH-B_LF_SN-MFG]
J22  TS-106-G-AA  [HDRV6W46P0X254_1X6_1524X254X676P]
J24  TS-106-G-AA  [HDRV6W46P0X254_1X6_1524X254X676P]
P6  Header 4  [HDR1X4]

### Blocks framed on the sheet
Main Motor Driver: J22 J24
Motor Driver: J20 J21 P6

### Ports
FR_ENCODER_A (out, see Main[4B], MicroController[1B]), FR_ENCODER_B (out, see Main[4B], MicroController[1B]), FR_INA (in, see Main[4B], MicroController[2C]), FR_INB (in, see Main[4C], MicroController[2C]), FR_PWM (in, see Main[4C], MicroController[1D]), RR_ENCODER_A (out, see Main[4B], MicroController[1B]), RR_ENCODER_B (out, see Main[4B], MicroController[1B]), RR_INA (in, see Main[4C], MicroController[2C]), RR_INB (in, see Main[4C], MicroController[2C]), RR_PWM (in, see Main[4C], MicroController[1D])

### Nets
+3V3: J20.3 J20.7
+5: J20.10 J22.3 J24.3
+12: J21.2
GND: J20.1 J20.11 J21.1 J22.4 J24.4
NetJ20_2: J20.2 ; port RR_PWM
NetJ20_4: J20.4 ; port RR_INB
NetJ20_5: J20.5 ; port RR_INA
NetJ20_6: J20.6 ; port FR_PWM
NetJ20_8: J20.8 ; port FR_INB
NetJ20_9: J20.9 ; port FR_INA
NetJ22_1: J22.1 P6.1
NetJ22_2: J22.2 P6.2
NetJ22_5: J22.5 ; port FR_ENCODER_A
NetJ22_6: J22.6 ; port FR_ENCODER_B
NetJ24_1: J24.1 P6.3
NetJ24_2: J24.2 P6.4
NetJ24_5: J24.5 ; port RR_ENCODER_A
NetJ24_6: J24.6 ; port RR_ENCODER_B

Not connected (* = marked no-connect by the designer): J20 MP1 MP2

### Library data of the parts
J20 = BM11B-GHS-TBT_LF__SN__N_: Connector; Manufacturer_Name: JST (JAPAN SOLDERLESS TERMINALS); Manufacturer_Part_Number: BM11B-GHS-TBT(LF)(SN)(N); Datasheet Link: http://www.jst-mfg.com/product/pdf/eng/eGH.pdf; Height: 4.35mm; Mouser Part Number: N/A; Mouser Price/Stock: https://www.mouser.com/Search/Refine.aspx?Keyword=N%2FA
J21 = CMP-17439-000297-1: CONN HEADER VERT 2POS 3.96MM; Number of Positions: 2; Pitch: 0.156inch; Voltage Rating: 250V; Termination: Solder; Lead Free: Lead Free; Insulation Color: Natural; Contact Material: Brass; Flammability Rating: UL94 V-0; Packaging: Bulk; Contact Mating Length: 0.303inch; Color: Natural; Contact Shape: Square; Contact Plating: Tin; Number of Rows: 1; Insulation Material: PBT; Connector Type: Header; Contact Finish - Mating: TIN; Mount: Through Hole; Fastening Type: Friction; Contact Type: Male Pin; Series: VH
J22 J24 = TS-106-G-AA: Connector; Manufacturer_Name: SAMTEC; Datasheet Link: http://suddendocs.samtec.com/catalog_english/ts.pdf; Height: 6.76mm; Manufacturer_Part_Number: TS-106-G-AA; Mouser Part Number: 200-TS106GAA; Mouser Price/Stock: https://www.mouser.com/Search/Refine.aspx?Keyword=200-TS106GAA; Arrow Part Number: TS-106-G-AA; Arrow Price/Stock: https://www.arrow.com/en/products/ts-106-g-aa/samtec
P6 = Header 4: Header, 4-Pin; LatestRevisionDate: 17-Jul-2002; LatestRevisionNote: Re-released for DXP Platform.; Publisher: Altium Limited

## Sheet Shooter.SchDoc
size A; SheetNumber: 7; SheetTotal: 11
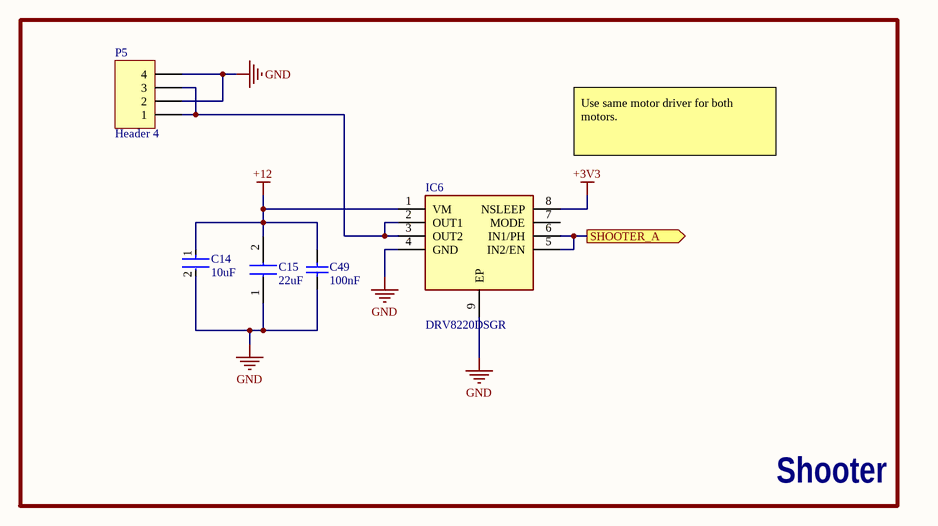
[diagram p4: Shooter.SchDoc]

### Parts
C14  Capacitance: 10uF  [FP-CL05A106MP5NUNC-MFG]  (hidden comment: CL05A106MP5NUNC)
C15  value 22uF  [CAPC1608X105N]  (hidden comment: CL10A226MP8NUNE)
C49  Capacitance: 100nF  [CAPC1050X55X23ML05T13]  (hidden comment: CL05B104KO5NNNC)
IC6  DRV8220DSGR  [SON50P200X200X80-9N]
P5  Header 4  [HDR1X4]

### Blocks framed on the sheet
Shooter: C14 C15 C49 IC6 P5

### Ports
SHOOTER_A (out, see Main[4B], MicroController[1B])

### Nets
+3V3: IC6.8(NSLEEP)
+12: C14.1 C15.2 C49.2 IC6.1(VM)
GND: C14.2 C15.1 C49.1 IC6.4(GND) IC6.9(EP) P5.2 P5.4
NetIC6_2: IC6.2(OUT1) IC6.3(OUT2) P5.1 P5.3
NetIC6_5: IC6.5(IN2/EN) IC6.6(IN1/PH) ; port SHOOTER_A

Not connected (* = marked no-connect by the designer): IC6 7(MODE)

### Notes on the sheet
- Use same motor driver for both motors.

### Library data of the parts
C14 = CMP-13271-000002-1: as C42 on sheet MicroController; Octopart: https://octopart.com/cl05a106mp5nunc-samsung-22457395; Voltage Rating: 10V; RoHS: TRUE; Value: 10uF; Height: 0.7mm; Digikey Description: CAP CER 10UF 10V X5R 0402; Automotive: No; Package: CL05A106MP5NUNC; Device Class L1: Passive Components; Temperature Range High: +85°C; ComponentLink2Description: Datasheet; Device Class L2: Capacitors; Temperature Characteristic: X5R; Manufacturer Part Number: CL05A106MP5NUNC; Temperature: -55°C to +85°C; ComponentLink2URL: http://www.samsungsem.com/kr/support/product-search/mlcc/__icsFiles/afieldfile/2019/05/10/19-CL05A106MP5NUNC.pdf; Device Class L3: Ceramic Capacitors; Category: Cap; Temperature Range Low: -55°C; Ipc Land Pattern Name: CAPC10050X50; Lead Free: Yes
C15 = CL10A226MP8NUNE: Capacitor; Manufacturer_Name: SAMSUNG; Datasheet Link: https://datasheet.datasheetarchive.com/originals/distributors/Datasheets-DGA10/2407063.pdf; Height: 1.05mm; Manufacturer_Part_Number: CL10A226MP8NUNE; Mouser Part Number: 187-CL10A226MP8NUNE; Mouser Price/Stock: https://www.mouser.co.uk/ProductDetail/Samsung-Electro-Mechanics/CL10A226MP8NUNE?qs=gRKWieUq2Hb5O0PTfRKzDQ%3D%3D; Arrow Part Number: CL10A226MP8NUNE; Arrow Price/Stock: https://www.arrow.com/en/products/cl10a226mp8nune/samsung-electro-mechanics?region=nac
C49 = CMP-2000-05439-1: as C12 on sheet MicroController; Case Size/Dimension: 0402; Tolerance (%): ±10%; Manufacturer URL: http://www.samsungsem.com/global/index.jsp; Datasheet URL: https://datasheet.ciiva.com/29198/458718-da-01-en-vs-kondensator-0402-29198423.pdf; Datasheet Version: Nov-10
IC6 = DRV8220DSGR: Integrated Circuit; Manufacturer_Name: Texas Instruments; Datasheet Link: https://www.ti.com/lit/gpn/drv8220; Height: 0.8mm; Manufacturer_Part_Number: DRV8220DSGR; Mouser Part Number: 595-DRV8220DSGR; Mouser Price/Stock: https://www.mouser.co.uk/ProductDetail/Texas-Instruments/DRV8220DSGR?qs=A6eO%252BMLsxmR1BpX9iMystg%3D%3D; Arrow Part Number: DRV8220DSGR; Arrow Price/Stock: https://www.arrow.com/en/products/drv8220dsgr/texas-instruments?region=nac
P5 = Header 4: Header, 4-Pin; LatestRevisionDate: 17-Jul-2002; LatestRevisionNote: Re-released for DXP Platform.; Publisher: Altium Limited

## Sheet FrontIrArray.SchDoc
size A; SheetNumber: 6; SheetTotal: 11
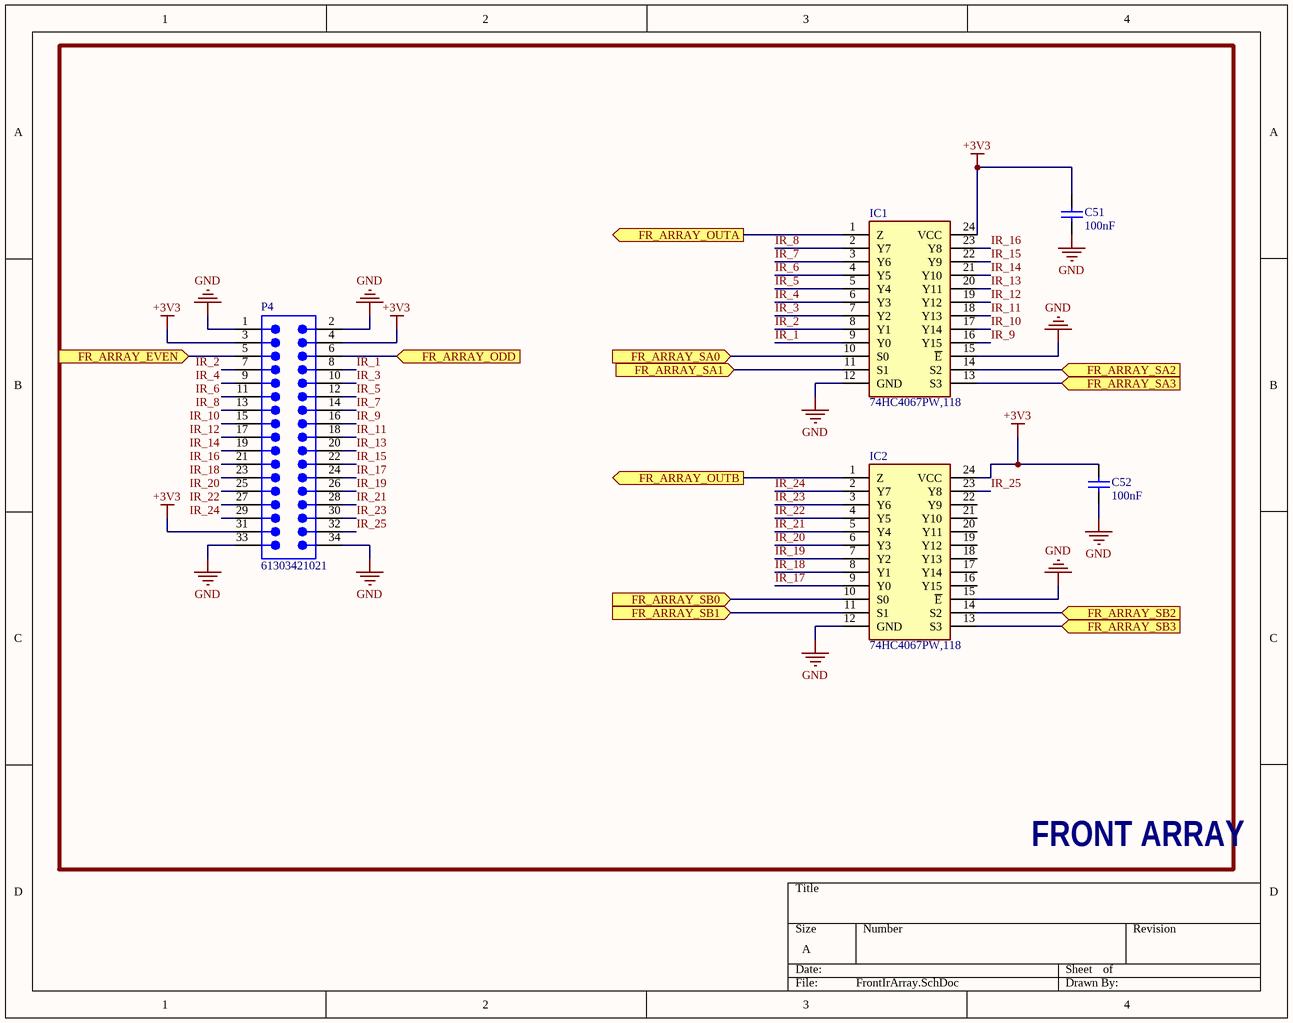
[diagram p5: FrontIrArray.SchDoc]

### Parts
C51  Capacitance: 100nF  [CAPC1050X55X23ML05T13]  (hidden comment: CL05B104KO5NNNC)
C52  Capacitance: 100nF  [CAPC1050X55X23ML05T13]  (hidden comment: CL05B104KO5NNNC)
IC1  74HC4067PW,118  [SOP65P640X110-24N]
IC2  74HC4067PW,118  [SOP65P640X110-24N]
P4  61303421021  [61303421021]

### Blocks framed on the sheet
FRONT ARRAY: C51 C52 IC1 IC2 P4

### Ports
FR_ARRAY_EVEN (in, see Main[4A], MicroController[1C]), FR_ARRAY_ODD (in, see Main[4A], MicroController[1C]), FR_ARRAY_OUTA (out, see Main[3A], MicroController[1C]), FR_ARRAY_OUTB (out, see Main[3A], MicroController[1C]), FR_ARRAY_SA0 (in, see Main[3A], MicroController[2C]), FR_ARRAY_SA1 (in, see Main[3A], MicroController[2C]), FR_ARRAY_SA2 (in, see Main[3A], MicroController[2C]), FR_ARRAY_SA3 (in, see Main[3A], MicroController[2C]), FR_ARRAY_SB0 (in, see Main[3A], MicroController[2C]), FR_ARRAY_SB1 (in, see Main[3A], MicroController[2C]), FR_ARRAY_SB2 (in, see Main[4A], MicroController[2C]), FR_ARRAY_SB3 (in, see Main[4A], MicroController[2C])

### Nets
+3V3: C51.1 C52.1 IC1.24(VCC) IC2.24(VCC) P4.3 P4.4 P4.31
GND: C51.2 C52.2 IC1.12(GND) IC1.15(~{E}) IC2.12(GND) IC2.15(~{E}) P4.1 P4.2 P4.33 P4.34
IR_1: IC1.9(Y0) P4.8
IR_2: IC1.8(Y1) P4.7
IR_3: IC1.7(Y2) P4.10
IR_4: IC1.6(Y3) P4.9
IR_5: IC1.5(Y4) P4.12
IR_6: IC1.4(Y5) P4.11
IR_7: IC1.3(Y6) P4.14
IR_8: IC1.2(Y7) P4.13
IR_9: IC1.16(Y15) P4.16
IR_10: IC1.17(Y14) P4.15
IR_11: IC1.18(Y13) P4.18
IR_12: IC1.19(Y12) P4.17
IR_13: IC1.20(Y11) P4.20
IR_14: IC1.21(Y10) P4.19
IR_15: IC1.22(Y9) P4.22
IR_16: IC1.23(Y8) P4.21
IR_17: IC2.9(Y0) P4.24
IR_18: IC2.8(Y1) P4.23
IR_19: IC2.7(Y2) P4.26
IR_20: IC2.6(Y3) P4.25
IR_21: IC2.5(Y4) P4.28
IR_22: IC2.4(Y5) P4.27
IR_23: IC2.3(Y6) P4.30
IR_24: IC2.2(Y7) P4.29
IR_25: IC2.23(Y8) P4.32
NetIC1_1: IC1.1(Z) ; port FR_ARRAY_OUTA
NetIC1_10: IC1.10(S0) ; port FR_ARRAY_SA0
NetIC1_11: IC1.11(S1) ; port FR_ARRAY_SA1
NetIC1_13: IC1.13(S3) ; port FR_ARRAY_SA3
NetIC1_14: IC1.14(S2) ; port FR_ARRAY_SA2
NetIC2_1: IC2.1(Z) ; port FR_ARRAY_OUTB
NetIC2_10: IC2.10(S0) ; port FR_ARRAY_SB0
NetIC2_11: IC2.11(S1) ; port FR_ARRAY_SB1
NetIC2_13: IC2.13(S3) ; port FR_ARRAY_SB3
NetIC2_14: IC2.14(S2) ; port FR_ARRAY_SB2
NetP4_5: P4.5 ; port FR_ARRAY_EVEN
NetP4_6: P4.6 ; port FR_ARRAY_ODD

Not connected (* = marked no-connect by the designer): IC2 16(Y15) 17(Y14) 18(Y13) 19(Y12) 20(Y11) 21(Y10) 22(Y9)

### Library data of the parts
C51 C52 = CMP-2000-05439-1: as C12 on sheet MicroController; Case Size/Dimension: 0402; Tolerance (%): ±10%; Manufacturer URL: http://www.samsungsem.com/global/index.jsp; Datasheet URL: https://datasheet.ciiva.com/29198/458718-da-01-en-vs-kondensator-0402-29198423.pdf; Datasheet Version: Nov-10
IC1 IC2 = 74HC4067PW,118: Integrated Circuit; Manufacturer_Name: Nexperia; Datasheet Link: https://assets.nexperia.com/documents/data-sheet/74HC_HCT4067.pdf; Height: 1.1mm; Manufacturer_Part_Number: 74HC4067PW,118; Mouser Part Number: 771-74HC4067PW-T; Mouser Price/Stock: https://www.mouser.co.uk/ProductDetail/Nexperia/74HC4067PW118?qs=P62ublwmbi9BArRi%252BuDUjA%3D%3D; Arrow Part Number: 74HC4067PW,118; Arrow Price/Stock: https://www.arrow.com/en/products/74hc4067pw118/nexperia?region=nac
P4 = CMP-1502-01126-2: NexarPartId: 32855571; Pitch: 2.54mm; Current Rating: 3A; Gender: Male; Number of Positions: 34; Contact Resistance: 20mΩ; Connector Type: Male Pin; Voltage Rating: 250V; Contact Mating Length: 5.9944mm; Height: 5.23mm; Row Spacing: 2.54mm; REACH SVHC: Unknown; Number of Pins: 34; Contact Plating: Gold; Termination: Solder; Number of Contacts: 34; Contact Material: Copper; Packaging: Bulk; Lead Pitch: 2.54mm; Min Operating Temperature: -40°C; Max Operating Temperature: 105°C; Number of Rows: 2; Color: Black; RoHS: Compliant; Mount: Through Hole; Operating Supply Voltage: 250V

## Sheet RrIrArray.SchDoc
size A; SheetNumber: 5; SheetTotal: 11
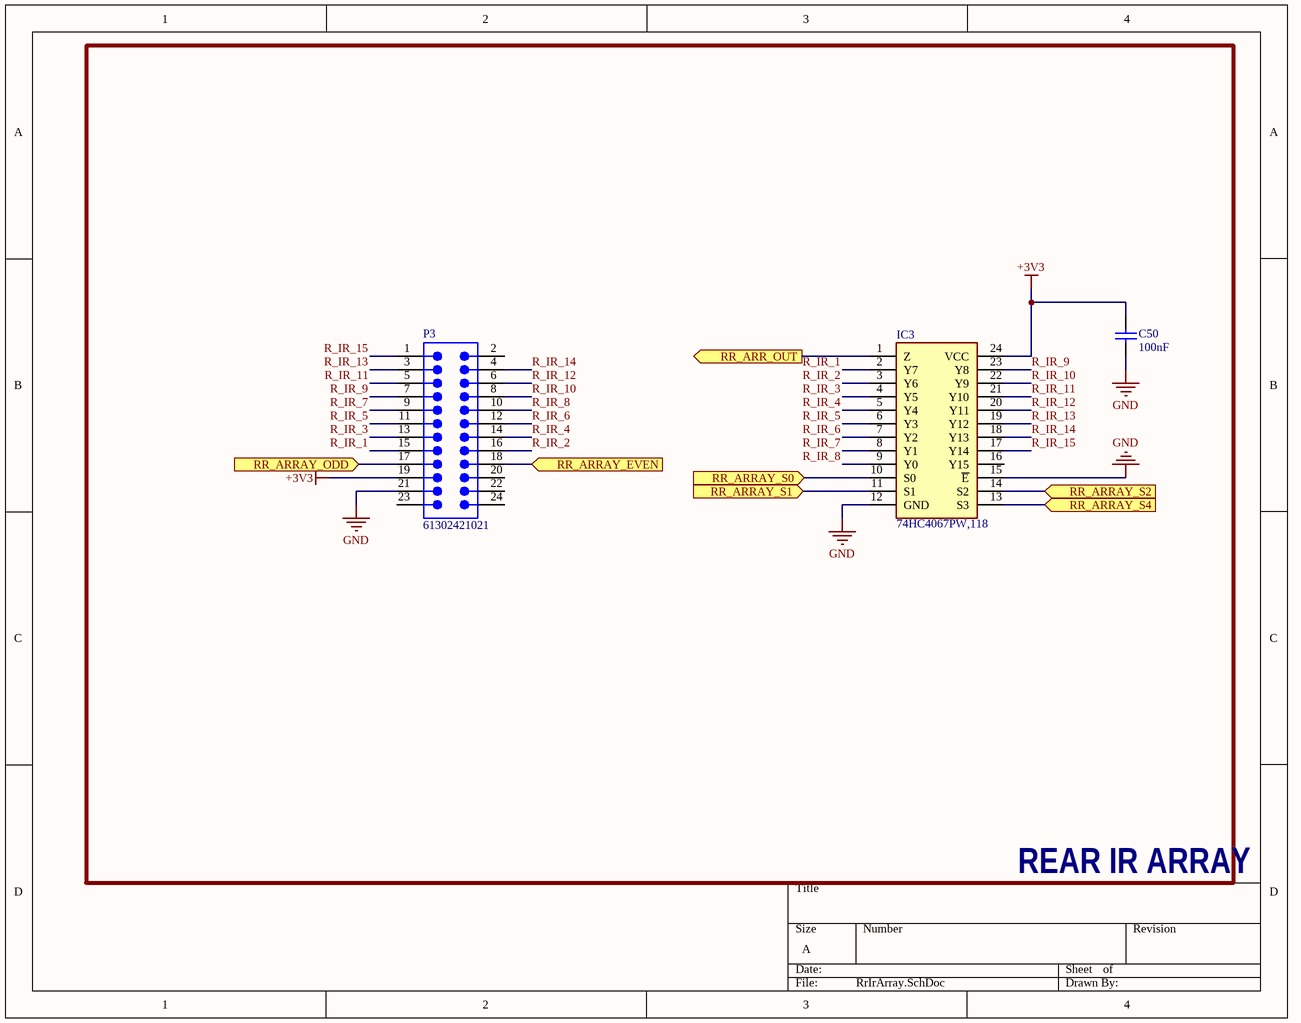
[diagram p6: RrIrArray.SchDoc]

### Parts
C50  Capacitance: 100nF  [CAPC1050X55X23ML05T13]  (hidden comment: CL05B104KO5NNNC)
IC3  74HC4067PW,118  [SOP65P640X110-24N]
P3  61302421021  [61302421021]

### Blocks framed on the sheet
REAR IR ARRAY: C50 IC3 P3

### Ports
RR_ARR_OUT (out, see Main[3C], MicroController[2B]), RR_ARRAY_EVEN (in, see Main[4C], MicroController[1C]), RR_ARRAY_ODD (in, see Main[4C], MicroController[1C]), RR_ARRAY_S0 (in, see Main[3C], MicroController[2B]), RR_ARRAY_S1 (in, see Main[3C], MicroController[2B]), RR_ARRAY_S2 (in, see Main[3C], MicroController[1D]), RR_ARRAY_S4 (in, see Main[3C], MicroController[1D])

### Nets
+3V3: C50.1 IC3.24(VCC) P3.19
GND: C50.2 IC3.12(GND) IC3.15(~{E}) P3.21
R_IR_1: IC3.2(Y7) P3.15
R_IR_2: IC3.3(Y6) P3.16
R_IR_3: IC3.4(Y5) P3.13
R_IR_4: IC3.5(Y4) P3.14
R_IR_5: IC3.6(Y3) P3.11
R_IR_6: IC3.7(Y2) P3.12
R_IR_7: IC3.8(Y1) P3.9
R_IR_8: IC3.9(Y0) P3.10
R_IR_9: IC3.23(Y8) P3.7
R_IR_10: IC3.22(Y9) P3.8
R_IR_11: IC3.21(Y10) P3.5
R_IR_12: IC3.20(Y11) P3.6
R_IR_13: IC3.19(Y12) P3.3
R_IR_14: IC3.18(Y13) P3.4
R_IR_15: IC3.17(Y14) P3.1
NetIC3_1: IC3.1(Z) ; port RR_ARR_OUT
NetIC3_10: IC3.10(S0) ; port RR_ARRAY_S0
NetIC3_11: IC3.11(S1) ; port RR_ARRAY_S1
NetIC3_13: IC3.13(S3) ; port RR_ARRAY_S4
NetIC3_14: IC3.14(S2) ; port RR_ARRAY_S2
NetP3_17: P3.17 ; port RR_ARRAY_ODD
NetP3_18: P3.18 ; port RR_ARRAY_EVEN

Not connected (* = marked no-connect by the designer): IC3 16(Y15); P3 2 20 22 23 24

### Library data of the parts
C50 = CMP-2000-05439-1: as C12 on sheet MicroController; Case Size/Dimension: 0402; Tolerance (%): ±10%; Manufacturer URL: http://www.samsungsem.com/global/index.jsp; Datasheet URL: https://datasheet.ciiva.com/29198/458718-da-01-en-vs-kondensator-0402-29198423.pdf; Datasheet Version: Nov-10
IC3 = 74HC4067PW,118: as IC1 on sheet FrontIrArray; Datasheet Link: https://assets.nexperia.com/documents/data-sheet/74HC_HCT4067.pdf; Height: 1.1mm; Manufacturer_Part_Number: 74HC4067PW,118; Mouser Part Number: 771-74HC4067PW-T; Mouser Price/Stock: https://www.mouser.co.uk/ProductDetail/Nexperia/74HC4067PW118?qs=P62ublwmbi9BArRi%252BuDUjA%3D%3D; Arrow Part Number: 74HC4067PW,118; Arrow Price/Stock: https://www.arrow.com/en/products/74hc4067pw118/nexperia?region=nac
P3 = CMP-1502-01110-2: NexarPartId: 32855562; Contact Resistance: 20mΩ; Gender: Male; Pitch: 2.54mm; Number of Contacts: 24; Current Rating: 3A; Operating Supply Voltage: 250V; Connector Type: Male Pin; REACH SVHC: Unknown; Lead Pitch: 2.54mm; Packaging: Bulk; Termination: Solder; Number of Positions: 24; Contact Mating Length: 5.9944mm; Color: Black; Contact Material: Copper; Mount: Through Hole; Contact Plating: Gold; Row Spacing: 2.54mm; Number of Pins: 24; RoHS: Compliant; Number of Rows: 2

## Sheet IMU Unit.SchDoc
size A; SheetNumber: 4; SheetTotal: 11
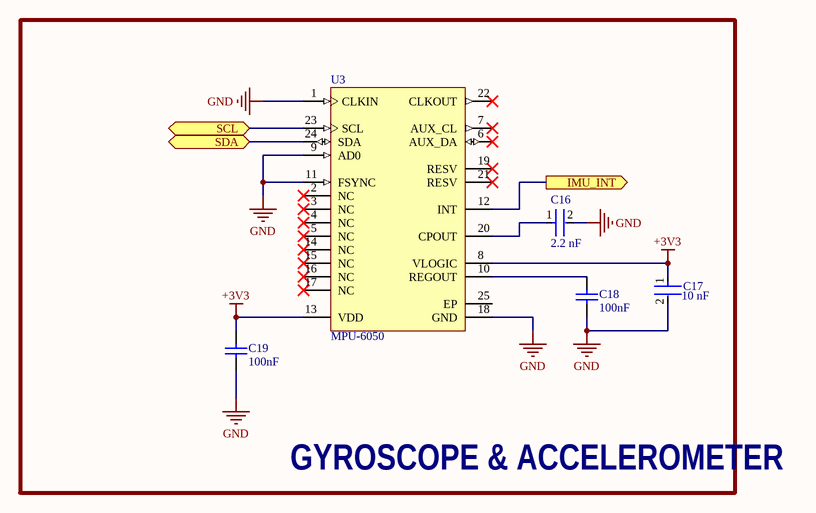
[diagram p7: IMU Unit.SchDoc]

### Parts
C16  Capacitance: 2.2 nF  [FP-CC0402-MFG]  (hidden comment: CC0402KRX7R9BB222)
C17  Capacitance: 10 nF  [FP-CC0402-MFG]  (hidden comment: CC0402KRX7R9BB103)
C18  Capacitance: 100nF  [CAPC1050X55X23ML05T13]  (hidden comment: CL05B104KO5NNNC)
C19  Capacitance: 100nF  [CAPC1050X55X23ML05T13]  (hidden comment: CL05B104KO5NNNC)
U3  MPU-6050  [IS-QFN-24_V]

### Blocks framed on the sheet
GYROSCOPE & ACCELEROMETER: C16-C19 U3

### Ports
IMU_INT (out, see Main[3C], MicroController[1A]), SCL (bidir, see Main[3C]), SDA (bidir, see Main[3C])

### Nets
+3V3: C17.1 C19.2 U3.8(VLOGIC) U3.13(VDD)
GND: C16.2 C17.2 C18.1 C19.1 U3.1(CLKIN) U3.9(AD0) U3.11(FSYNC) U3.18(GND)
MCU_SCL_1: U3.23(SCL) ; port SCL
MCU_SDA_1: U3.24(SDA) ; port SDA
NetC16_1: C16.1 U3.20(CPOUT)
NetC18_2: C18.2 U3.10(REGOUT)
NetU1_5: U3.12(INT) ; port IMU_INT

Not connected (* = marked no-connect by the designer): U3 2(NC)* 3(NC)* 4(NC)* 5(NC)* 6(AUX_DA)* 7(AUX_CL)* 14(NC)* 15(NC)* 16(NC)* 17(NC)* 19(RESV)* 21(RESV)* 22(CLKOUT)* 25(EP)

### Library data of the parts
C16 = CMP-1034-01742-2: CAP CER 2200PF 50V X7R 0402; Manufacturer: YAGEO; Material: Ceramic; Automotive Grade: NA; Temperature Coefficient: 30ppm/°C; Tolerance: 0.1; Value: 2.2 nF; Footprint Url: http://www.yageo.com/exep/pages/download/literatures/UPY-C_GEN_24.pdf; Temperature: -55°C to +125°C; RoHS: TRUE; Mouser Description: Multilayer Ceramic Capacitors MLCC - SMD/SMT 2.2nF 50V X7R 10%; Temperature Range Low: -55°C; ComponentLink2URL: http://www.yageo.com/documents/recent/UPY-GP_NP0_16V-to-50V_16.pdf; Digikey Description: CAP CER 2200PF 50V X7R 0402; Manufacturer Part Number: CC0402KRX7R9BB222; Device Class L3: Ceramic Capacitors; Lead Free: Yes; Octopart: https://octopart.com/cc0402krx7r9bb222-yageo-39467642; Package: CC0402; ComponentLink2Description: Datasheet; Category: Cap; Device Class L1: Passive Components; Height: 0.55mm; Temperature Characteristic: X7R; Device Class L2: Capacitors; Voltage Rating: 50 V; Ipc Land Pattern Name: CAPC10050X50; Temperature Range High: +125°C; Automotive: No
C17 = CMP-2100-03592-2: CAP CER 10000PF 50V X7R 0402; Manufacturer: YAGEO; Temperature Coefficient: 30ppm/°C; Material: Ceramic; Automotive Grade: NA; Tolerance: 0.1; Value: 10 nF; Device Class L3: Ceramic Capacitors; Temperature: -55°C to +125°C; Footprint Url: http://www.yageo.com/exep/pages/download/literatures/UPY-C_GEN_24.pdf; Ipc Land Pattern Name: CAPC10050X50; Device Class L1: Passive Components; Automotive: No; Octopart: https://octopart.com/cc0402krx7r9bb103-yageo-8376513; Manufacturer Part Number: CC0402KRX7R9BB103; Lead Free: Yes; Temperature Range Low: -55°C; Height: 0.55mm; ComponentLink2URL: http://www.yageo.com/documents/recent/UPY-GP_NP0_16V-to-50V_16.pdf; Category: Cap; ComponentLink2Description: Datasheet; Temperature Range High: +125°C; Digikey Description: CAP CER 10000PF 50V X7R 0402; Voltage Rating: 50 V; Package: CC0402; Device Class L2: Capacitors; Mouser Description: 0402 10 nF 50 V ±10 % Tolerance X7R SMT Multilayer Ceramic Capacitor; RoHS: TRUE; Temperature Characteristic: X7R
C18 C19 = CMP-2000-05439-1: as C12 on sheet MicroController; Case Size/Dimension: 0402; Tolerance (%): ±10%; Manufacturer URL: http://www.samsungsem.com/global/index.jsp; Datasheet URL: https://datasheet.ciiva.com/29198/458718-da-01-en-vs-kondensator-0402-29198423.pdf; Datasheet Version: Nov-10
U3 = CMP-1753-00002-2: 3-Axis Gyroscope, Accelerometer and a Digital Motion Processor(TM) (DMP), 2.375 to 3.46 V, -40 to 85 degC, 24-Pin QFN, RoHS, Tape and Reel; Manufacturer: InvenSense; Featured Product: MPU-60506-Axis,IntegratedI²CSolution; Other Names: 1428-1007-2 / MPU6050; Sensor Type: MotionTracking; Online Catalog: MPU-6000™Series; Unit PriceUSD: Digital; Datasheet Version: Rev. 3.3, 05/2012; Category: Sensors,Transducers; Datasheet URL: http://datasheet.octopart.com/MPU-6050-InvenSense-datasheet-14421344.pdf; Family: Multifunction; Standard Package: 5,000; Manufacturer URL: http://www.invensense.com/; Output Type: Digital; Dynamic Catalog: MPU-6000™Series

## Sheet Power.SchDoc
size A; SheetNumber: 8; SheetTotal: 11
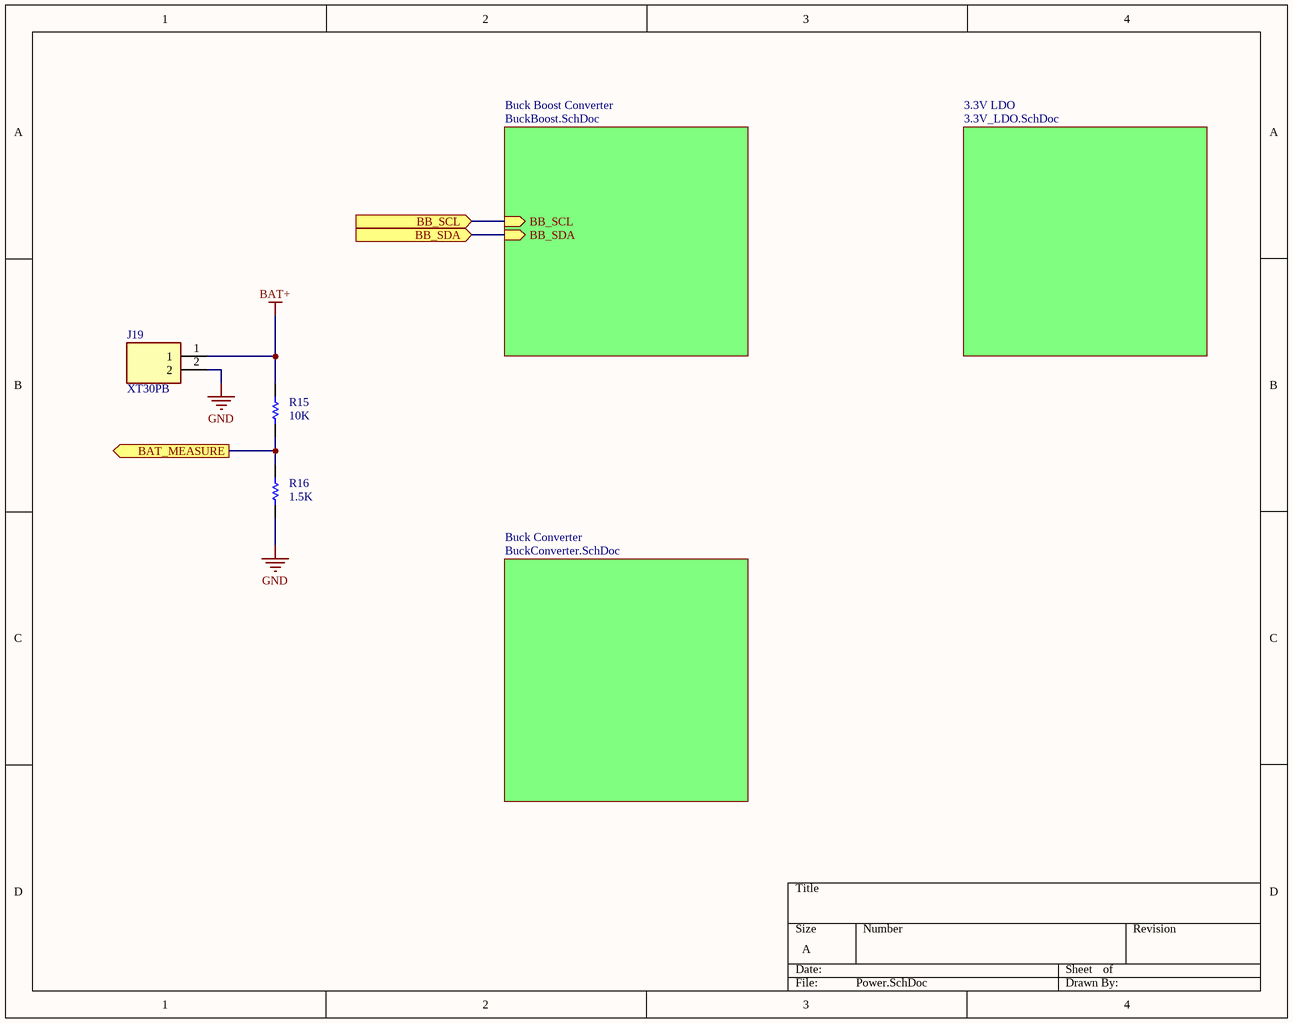
[diagram p8: Power.SchDoc]

### Parts
J19  XT30PB  [XT30PB]
R15  Resistance: 10K  [RESC1005X40X25LL05T10]  (hidden comment: RC0402FR-0710KL)
R16  Resistance: 1.5K  [RESC1005X40X25ML05T10]  (hidden comment: RC0402FR-071K5L)

### Sub-sheets
3.3V LDO = 3.3V_LDO.SchDoc: no entries
Buck Boost Converter = BuckBoost.SchDoc: BB_SCL (in), BB_SDA (in)
Buck Converter = BuckConverter.SchDoc: no entries

### Ports
BAT_MEASURE (out, see Main[3B], MicroController[1C]), BB_SCL (in), BB_SDA (in)

### Nets
BAT+: J19.1 R15.2
GND: J19.2 R16.1
MCU_SCL_1: port BB_SCL, sheet Buck Boost Converter/BB_SCL
MCU_SDA_1: port BB_SDA, sheet Buck Boost Converter/BB_SDA
NetR15_1: R15.1 R16.2 ; port BAT_MEASURE

### Library data of the parts
J19 = XT30PB: Connector; Manufacturer_Name: Amass; Datasheet Link: https://www.tme.eu/Document/4acc913878197f8c2e30d4b8cdc47230/XT30UPB%20SPEC.pdf; Height: 10.7mm; Manufacturer_Part_Number: XT30PB
R15 = CMP-2002-07353-1: Manufacturer: Yageo / Phycomp; Part Number: RC0402FR-0710KL
R16 = CMP-2002-07464-1: Manufacturer: Yageo / Phycomp; Part Number: RC0402FR-071K5L

## Sheet BuckConverter.SchDoc
size A; SheetNumber: 10; SheetTotal: 11
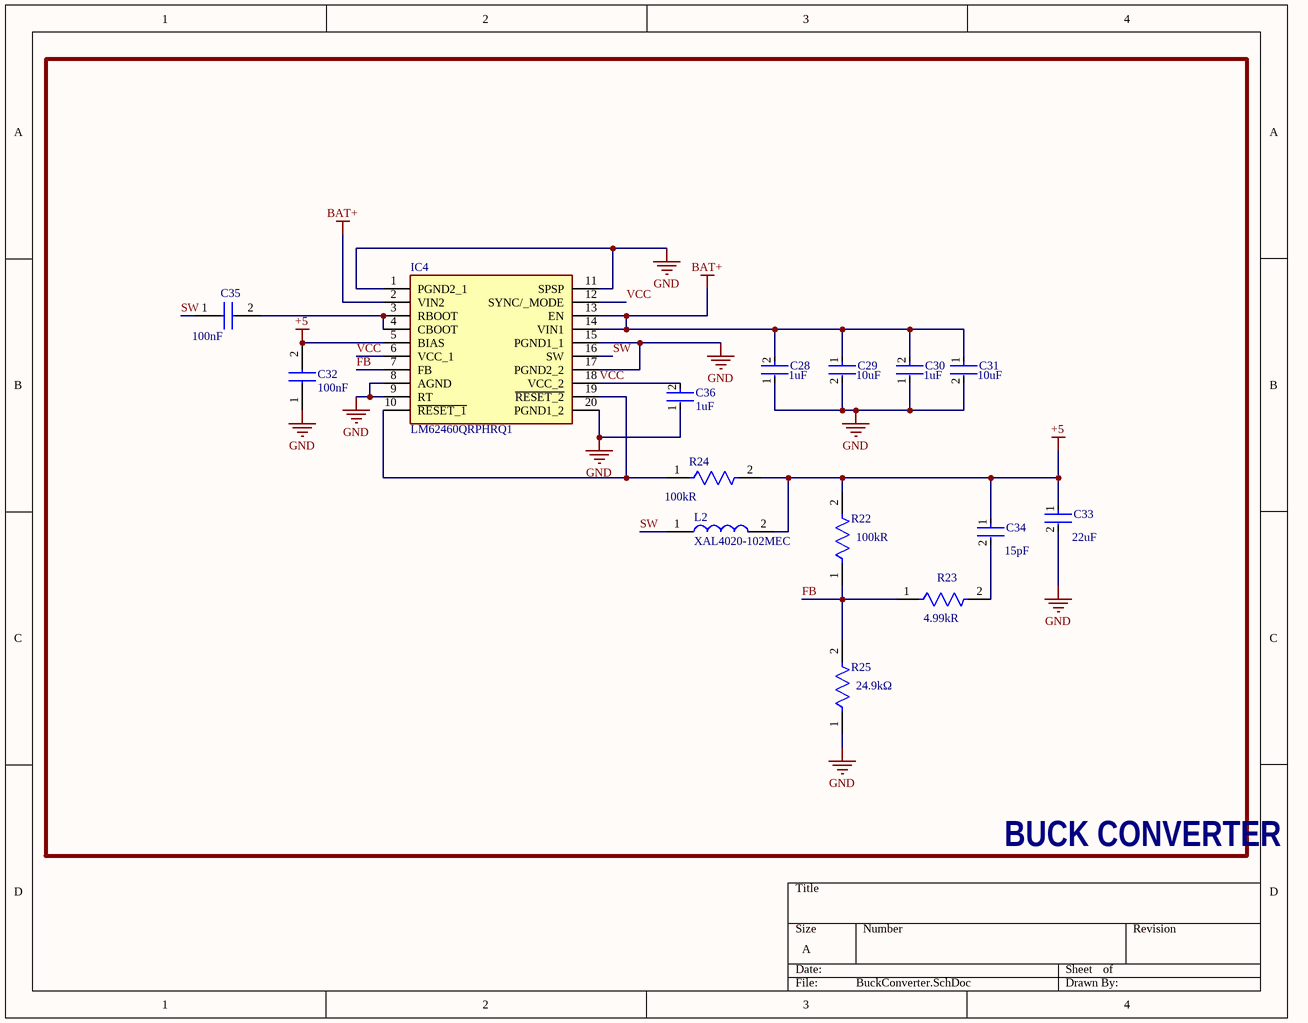
[diagram p9: BuckConverter.SchDoc]

### Parts
C28  Capacitance: 1uF  [FP-C1608-080-0_1-IPC_B]  (hidden comment: C1608X5R1H105K080AB)
C29  Capacitance: 10uF  [FP-GRM32-MFG]  (hidden comment: GRM32ER71H106KA12L)
C30  Capacitance: 1uF  [FP-C1608-080-0_1-IPC_B]  (hidden comment: C1608X5R1H105K080AB)
C31  Capacitance: 10uF  [FP-GRM32-MFG]  (hidden comment: GRM32ER71H106KA12L)
C32  capacitance: 100nF  [CAPC1005X55N]  (hidden comment: GRM155R71A104KA01D)
C33  Capacitance: 22uF  [FP-GRM21B-0_2-e0_2_0_7-IPC_C]  (hidden comment: GRM21BR61A226ME44L)
C34  Capacitance: 15pF  [FP-CGA1A-0_1-0_03-IPC_C]  (hidden comment: CGA1A2C0G1E150J030BA)
C35  capacitance: 100nF  [CAPC1005X55N]  (hidden comment: GRM155R71A104KA01D)
C36  Capacitance: 1uF  [FP-GRM188-0_1-MFG]  (hidden comment: GRM188R60J105KA01D)
IC4  LM62460QRPHRQ1  [LM62460QRPHRQ1]
L2  XAL4020-102MEC  [XAL40XX]
R22  Resistance: 100kR  [FP-CRCW0402-e3-IPC_C]  (hidden comment: CRCW0402100KFKED)
R23  Resistance: 4.99kR  [FP-CRCW0402-e3-MFG]  (hidden comment: CRCW04024K99FKED)
R24  Resistance: 100kR  [FP-CRCW0402-e3-IPC_C]  (hidden comment: CRCW0402100KFKED)
R25  Resistance: 24.9kΩ  [FP-RC_L0603-MFG]  (hidden comment: RC0603FR-0724K9L)

### Blocks framed on the sheet
BUCK CONVERTER: C28-C36 IC4 L2 R22-R25

### Nets
+5: C32.2 C33.1 C34.1 IC4.5(BIAS) L2.2 R22.2 R24.2
BAT+: C28.2 C29.1 C30.2 C31.1 IC4.2(VIN2) IC4.13(EN) IC4.14(VIN1)
GND: C28.1 C29.2 C30.1 C31.2 C32.1 C33.2 C36.1 IC4.1(PGND2_1) IC4.8(AGND) IC4.9(RT) IC4.11(SPSP) IC4.15(PGND1_1) IC4.17(PGND2_2) IC4.20(PGND1_2) R25.1
FB: IC4.7(FB) R22.1 R23.1 R25.2
SW: C35.1 IC4.16(SW) L2.1
VCC: C36.2 IC4.6(VCC_1) IC4.12(SYNC/_MODE) IC4.18(VCC_2)
NetC34_2: C34.2 R23.2
NetC35_2: C35.2 IC4.3(RBOOT) IC4.4(CBOOT)
NetIC4_10: IC4.10(~{RESET_1}) IC4.19(~{RESET_2}) R24.1

### Library data of the parts
C28 C30 = CMP-2000-06025-2: as C11 on sheet MicroController; Lead Free: Lead Free; Height: 0.8mm; Mount: Surface Mount; Radiation Hardening: No; Thickness: 0.035inch; Length: 1.6mm; Max Operating Temperature: 85°C; REACH SVHC: No SVHC; Min Operating Temperature: -55°C; Construction: Flat; RoHS Compliant: Yes; Voltage Rating: 50V; Dielectric: X5R; Packaging: Tape and Reel; Termination: SMD/SMT; Voltage Rating (DC): 50V; Case Code (Imperial): 0603; Voltage: 50V; Width: 0.031inch; Weight: 7.1E-05oz; Depth: 0.8mm; Case Code (Metric): 1608; Series: C; Case/Package: 0603; Tolerance: 10%; Resistor Type: Ceramic; Number of Pins: 2; Dielectric Material: Ceramic; Package Quantity: 1
C29 C31 = CMP-2000-05261-2: CAP CER 10UF 50V X7R 1210; Manufacturer: Murata; Tolerance: 10%; Material: Ceramic; Temperature Coefficient: 15%; Voltage Rating: 50V; Temperature Characteristic: X7R; Value: 10uF; ComponentLink2Description: Datasheet; Device Class L1: Passive Components; Lead Free: Yes; Temperature Range High: +125°C; Category: Cap; Manufacturer Part Number: GRM32ER71H106KA12L; ComponentLink2URL: https://search.murata.co.jp/Ceramy/image/img/A01X/G101/ENG/GRM32ER71H106KA12-01.pdf; Device Class L2: Capacitors; Package: GRM32; Mouser Description: 1210 10 uF 50 V ±10% Tolerance X7R SMT Multilayer Ceramic Capacitor; Octopart: https://octopart.com/grm32er71h106ka12l-murata-10470987; Digikey Description: CAP CER 10UF 50V X7R 1210; Height: 2.7mm; Temperature: -55°C to +125°C; Temperature Range Low: -55°C; RoHS: TRUE; Device Class L3: Ceramic Capacitors; Automotive: No
C32 C35 = GRM155R71A104KA01D: Capacitor; Manufacturer_Name: Murata Electronics; Datasheet Link: http://www.murata.com/~/media/webrenewal/support/library/catalog/products/capacitor/mlcc/c02e.pdf; Height: 0.55mm; Manufacturer_Part_Number: GRM155R71A104KA01D; Mouser Part Number: 81-GRM155R71A104KA1D; Mouser Price/Stock: https://www.mouser.co.uk/ProductDetail/Murata-Electronics/GRM155R71A104KA01D?qs=8YPuuxuUzMIpJ%252BESZ%2Fj8CQ%3D%3D; Arrow Part Number: GRM155R71A104KA01D; Arrow Price/Stock: https://www.arrow.com/en/products/grm155r71a104ka01d/murata-manufacturing?region=nac
C33 = CMP-06035-039918-1: Chip Multilayer Ceramic Capacitors for General Purpose, 0805, 22uF, X5R, 15%, 20%, 10V; Dissipation Factor: 0.035%; Min Operating Temperature: -55°C; Voltage Rating (DC): 10V; Height: 1.25mm; Depth: 1.25mm; Max Operating Temperature: 85°C; Width: 1.25mm; Lead Free: Lead Free; Dielectric Material: Ceramic; Weight: 0.000335oz; Tolerance: 20%; Voltage Rating: 10V; Case Code (Metric): 2012; Termination: SMD/SMT; Length: 2mm; Thickness: 0.057inch; Case/Package: 0805; Packaging: Tape and Reel; Voltage: 10V; Case Code (Imperial): 0805; Resistor Type: Ceramic; Package Quantity: 3000; Mount: Surface Mount; Dielectric: X5R
C34 = CMP-08246-001148-1: Cap Ceramic 15pF 25V C0G 5% Pad SMD 0201 125°C Automotive T/R; Packaging: Tape and Reel; Max Operating Temperature: 125°C; Tolerance: 5%; Composition: Ceramic; Ratings: AEC-Q200; Voltage Rating (DC): 25V; Case Code (Imperial): 0201; Min Operating Temperature: -55°C; Thickness: 0.013inch; Width: 0.012inch; Depth: 0.3mm; Case Code (Metric): 0603; Case/Package: 0201; Termination: SMD/SMT; Weight: 6E-06oz; Mount: Surface Mount; Package Quantity: 1; Voltage Rating: 25V; Dielectric: C0G; Length: 0.6mm; Height: 0.3mm
C36 = CMP-2006-02790-2: CAP CER 1UF 6.3V X5R 0603; Insulation Resistance: 500MR; Tolerance: 10%; Dielectric Material: Ceramic; Thickness: 0.035inch; Depth: 0.8mm; Min Operating Temperature: -55°C; Mount: Surface Mount; Voltage Rating (DC): 6.3V; Case/Package: 0603; Voltage Rating: 6.3V; Voltage: 6.3V; Max Operating Temperature: 85°C; Case Code (Imperial): 0603; Dielectric: X5R; Packaging: Tape and Reel; Height: 0.8mm; Case Code (Metric): 1608; Radiation Hardening: No; REACH SVHC: No SVHC; Width: 0.031inch; Package Quantity: 1; Lead Free: Lead Free; Length: 1.6mm; Termination: SMD/SMT
IC4 = LM62460QRPHRQ1: Integrated Circuit; Manufacturer_Name: Texas Instruments; Datasheet Link: https://www.ti.com/product/LM62460-Q1?HQS=TI-null-null-octopart-df-pf-null-wwe; Height: 1mm; Manufacturer_Part_Number: LM62460QRPHRQ1; Mouser Part Number: 595-LM62460QRPHRQ1; Mouser Price/Stock: https://www.mouser.co.uk/ProductDetail/Texas-Instruments/LM62460QRPHRQ1?qs=QNEnbhJQKvYn1QEWk8lAhA%3D%3D; Arrow Part Number: LM62460QRPHRQ1; Arrow Price/Stock: https://www.arrow.com/en/products/lm62460qrphrq1/texas-instruments?region=nac
L2 = XAL4020-102MEC: Inductor; Manufacturer_Name: COILCRAFT; Datasheet Link: https://www.coilcraft.com/pdfs/xal4000.pdf; Manufacturer_Part_Number: XAL4020-102MEC; Mouser Part Number: 994-XAL4020-102MEC; Mouser Price/Stock: https://www.mouser.co.uk/ProductDetail/Coilcraft/XAL4020-102MEC?qs=zCSbvcPd3pbLq0M7ZKfPRA%3D%3D
R22 R24 = CMP-2002-08123-3: RES Thick Film, 100kΩ, 1%, 0.063W, 100ppm/°C, 0402; Power Rating: 63mW; Voltage Rating (DC): 50V; Lead Free: Lead Free; Height: 0.35mm; Contact Plating: Tin; Min Operating Temperature: -55°C; Package Quantity: 10000; Case/Package: 0402; Temperature Coefficient: 100ppm/°C; Number of Terminations: 2; Packaging: Tape and Reel; Max Power Dissipation: 63mW; Case Code (Metric): 1005; Mount: Surface Mount; Width: 0.02inch; Termination: SMD/SMT; Length: 1mm; Number of Pins: 2; Weight: 2.3E-05oz; Radiation Hardening: No; Tolerance: 1%; Military Standard: Not; Features: Automotive AEC-Q200; Depth: 0.5mm; Composition: Thick Film; Max Operating Temperature: 155°C; Voltage Rating: 50V; Case Code (Imperial): 0402
R23 = CMP-2002-00057-2: as R18 on sheet MicroController; Package Quantity: 10; Max Power Dissipation: 63mW; Temperature Coefficient: 100ppm/°C; Lead Free: Lead Free; Mount: Surface Mount; Height: 0.35mm; Number of Terminations: 2; Contact Plating: Tin; Case/Package: 0402; Max Operating Temperature: 155°C; Case Code (Imperial): 0402; Weight: 2.3E-05oz; Width: 0.5mm; Features: Automotive AEC-Q200; Voltage Rating (DC): 50V; Tolerance: 1%; Min Operating Temperature: -55°C; Length: 1mm; Depth: 0.5mm; Military Standard: Not; Packaging: Tape and Reel; Radiation Hardening: No; Composition: Thick Film; Termination: SMD/SMT; Case Code (Metric): 1005
R25 = CMP-03412-013083-1: RES SMD 24.9K OHM 1% 1/10W 0603; Manufacturer: Yageo; Approved Alternate Part Number: 541-1.00HHCT-ND; Voltage Rating: 75V; Power Rating: 0.1W; Value: 24.9kΩ; Power: 100mW; Temperature Coefficient: 100ppm/°C; Footprint Url: https://www.yageo.com/upload/website/yageo_PYu-R_Mount_10_19050818_343.pdf; Automotive: No; Temperature Range Low: -55°C; Manufacturer Part Number: RC0603FR-0724K9L; Ipc Land Pattern Name: RESC16080X45; Digikey Description: RES SMD 24.9K OHM 1% 1/10W 0603; Voltage: 75V; Composition: Thick Film; Device Class L1: Passive Components; Device Class L2: Resistors; Device Class L3: Chip SMD Resistors; ComponentLink2URL: https://www.yageo.com/upload/media/product/productsearch/datasheet/rchip/PYu-RC_Group_51_RoHS_L_10.pdf; Series: RC_L; Octopart: https://octopart.com/rc0603fr-0724k9l-yageo-1189838; RoHS: TRUE; Category: Res; Height: 0.55mm; Tolerance: 1%; Temperature: -55°C to +155°C; Temperature Range High: +155°C; ComponentLink2Description: Datasheet; Package: RC_L0603; Lead Free: Yes; Mouser Description: Res Thick Film 1.6 x 0.8 mm 24.9K Ohm 1% 0.1W(1/10W) 100ppm/ C Molded SMD Paper T/R